# Altium project LimeSDR-QPCIe_1v2.PrjPcb (part 4 of 13)

## Sheet 11_RSSI2.SchDoc: RSSI2
size A3; Organization: Lime Microsystems; Address1: Surrey Tech Centre; Address2: Guildford GU2 7YG; Address3: Surrey; Address4: United Kingdom; Revision: v1.2; SheetNumber: 9; SheetTotal: 27
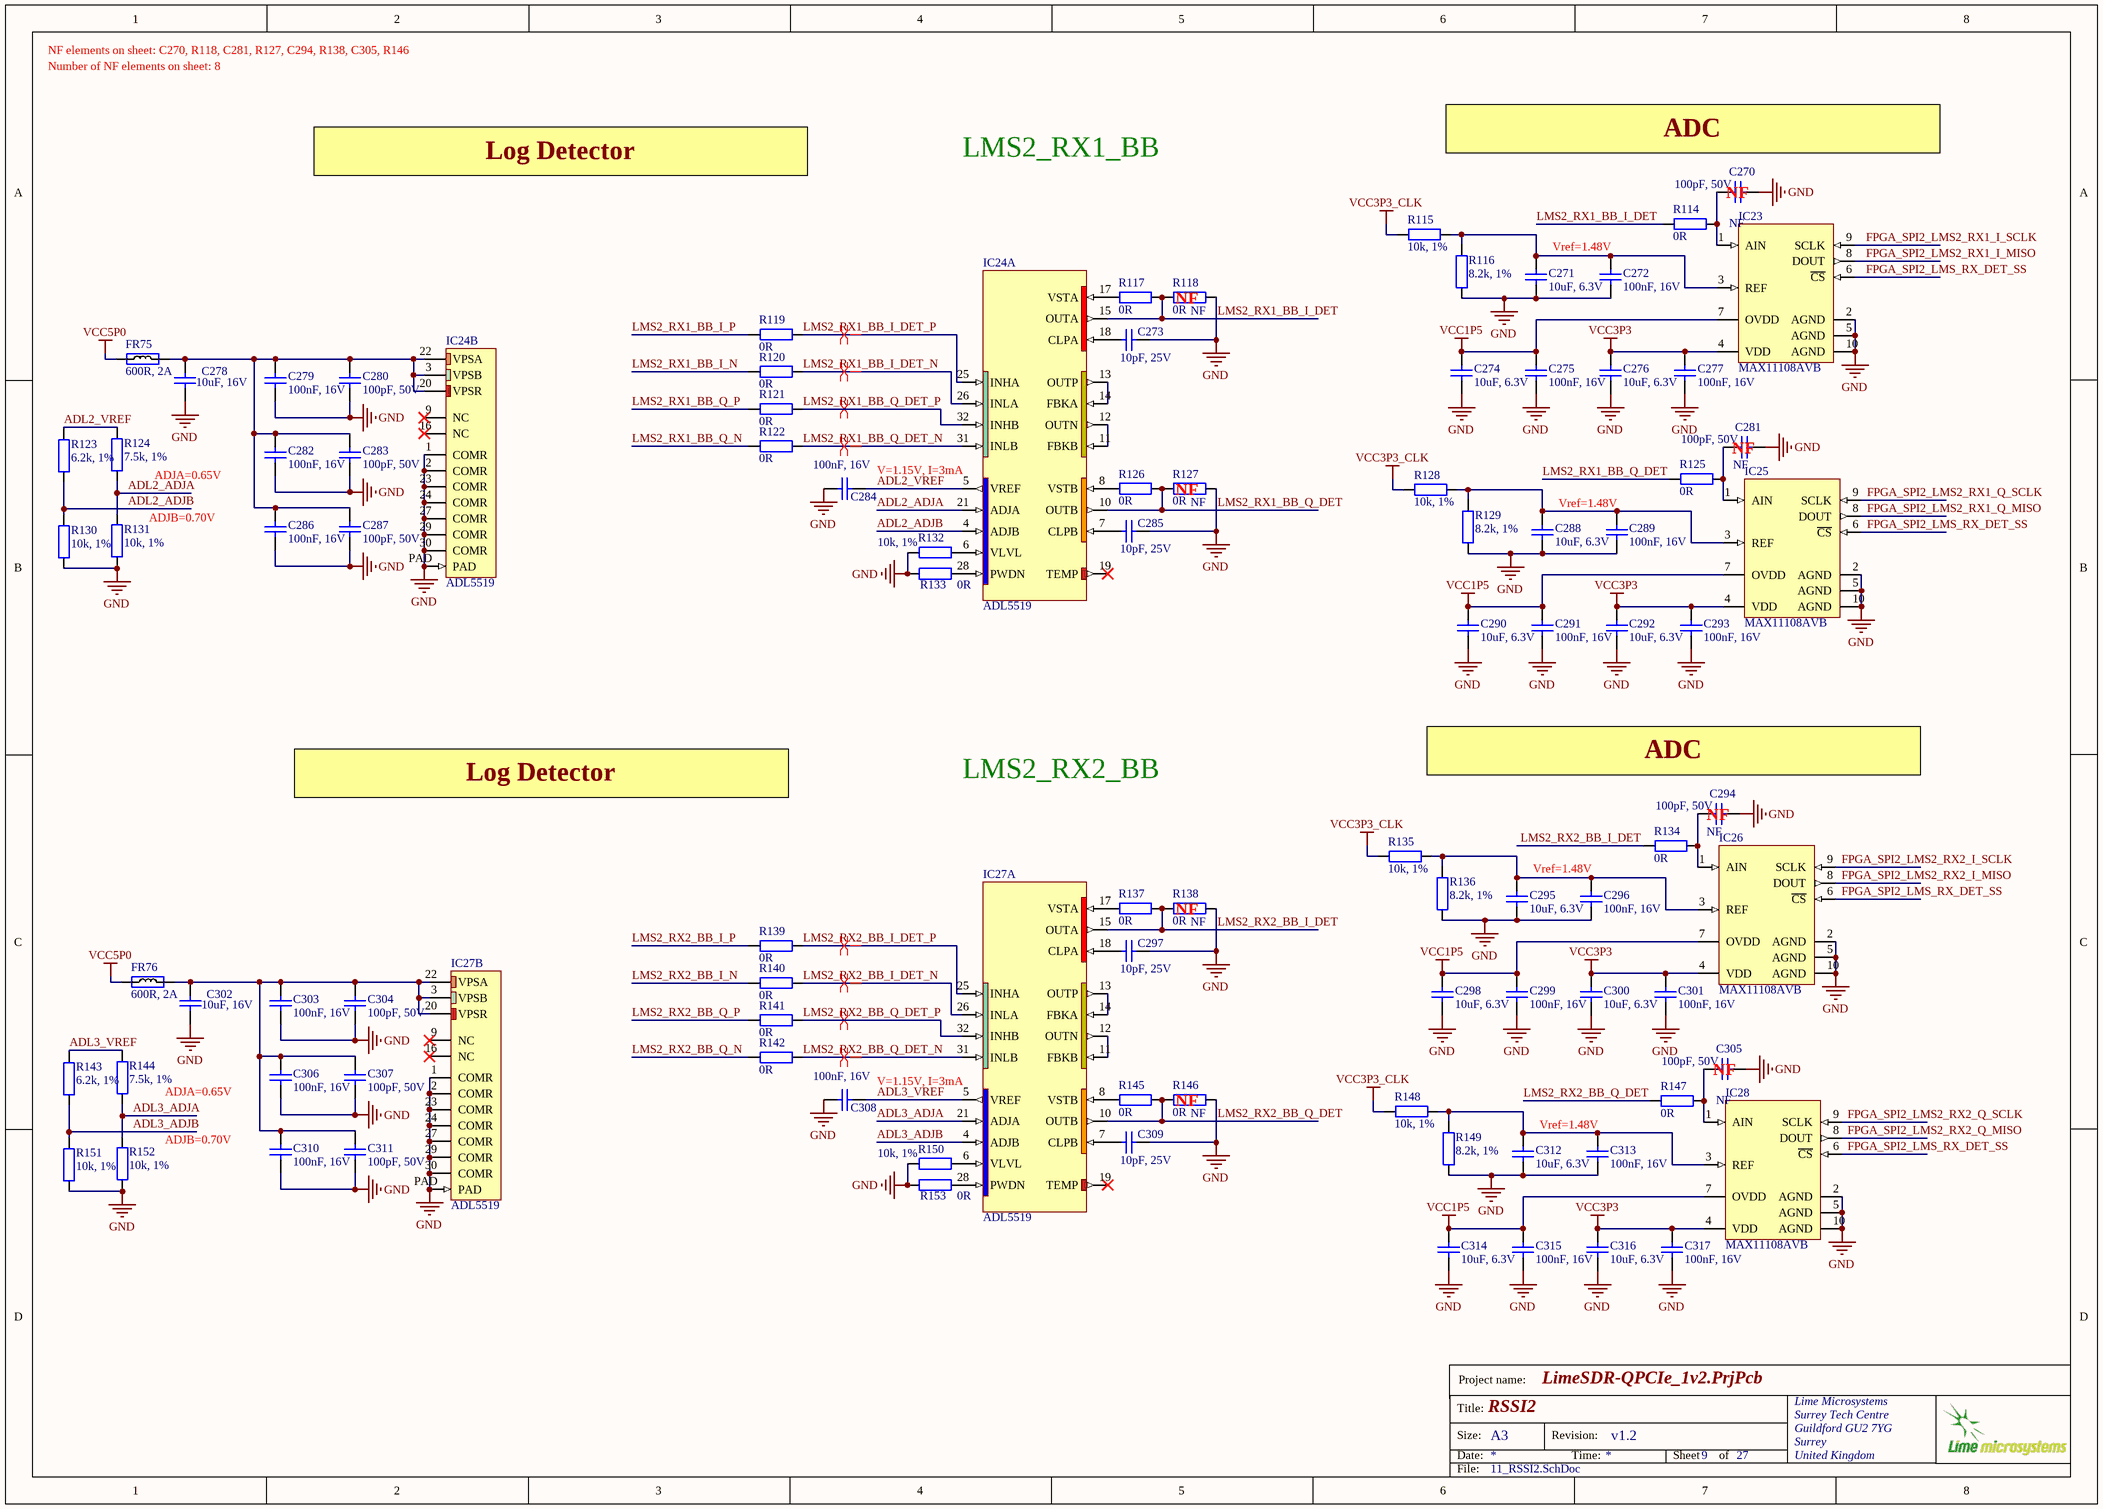
[diagram p10: 11_RSSI2.SchDoc]

### Parts
C270  100pF, 50V  Assembly Info: NF  [CAP0402]
C271  10uF, 6.3V  [CAP0603]
C272  100nF, 16V  [CAP0402]
C273  10pF, 25V  [CAP0402]
C274  10uF, 6.3V  [CAP0603]
C275  100nF, 16V  [CAP0402]
C276  10uF, 6.3V  [CAP0603]
C277  100nF, 16V  [CAP0402]
C278  10uF, 16V  [CAP0603]
C279  100nF, 16V  [CAP0402]
C280  100pF, 50V  [CAP0402]
C281  100pF, 50V  Assembly Info: NF  [CAP0402]
C282  100nF, 16V  [CAP0402]
C283  100pF, 50V  [CAP0402]
C284  100nF, 16V  [CAP0402]
C285  10pF, 25V  [CAP0402]
C286  100nF, 16V  [CAP0402]
C287  100pF, 50V  [CAP0402]
C288  10uF, 6.3V  [CAP0603]
C289  100nF, 16V  [CAP0402]
C290  10uF, 6.3V  [CAP0603]
C291  100nF, 16V  [CAP0402]
C292  10uF, 6.3V  [CAP0603]
C293  100nF, 16V  [CAP0402]
C294  100pF, 50V  Assembly Info: NF  [CAP0402]
C295  10uF, 6.3V  [CAP0603]
C296  100nF, 16V  [CAP0402]
C297  10pF, 25V  [CAP0402]
C298  10uF, 6.3V  [CAP0603]
C299  100nF, 16V  [CAP0402]
C300  10uF, 6.3V  [CAP0603]
C301  100nF, 16V  [CAP0402]
C302  10uF, 16V  [CAP0603]
C303  100nF, 16V  [CAP0402]
C304  100pF, 50V  [CAP0402]
C305  100pF, 50V  Assembly Info: NF  [CAP0402]
C306  100nF, 16V  [CAP0402]
C307  100pF, 50V  [CAP0402]
C308  100nF, 16V  [CAP0402]
C309  10pF, 25V  [CAP0402]
C310  100nF, 16V  [CAP0402]
C311  100pF, 50V  [CAP0402]
C312  10uF, 6.3V  [CAP0603]
C313  100nF, 16V  [CAP0402]
C314  10uF, 6.3V  [CAP0603]
C315  100nF, 16V  [CAP0402]
C316  10uF, 6.3V  [CAP0603]
C317  100nF, 16V  [CAP0402]
FR75  600R, 2A  [RES0805]
FR76  600R, 2A  [RES0805]
IC23  MAX11108AVB  [MAX11108AVB+T]
IC24  ADL5519  [ADL5519_32LFCSP]  (parts A,B of 2)
IC25  MAX11108AVB  [MAX11108AVB+T]
IC26  MAX11108AVB  [MAX11108AVB+T]
IC27  ADL5519  [ADL5519_32LFCSP]  (parts A,B of 2)
IC28  MAX11108AVB  [MAX11108AVB+T]
R114  0R  [RES0402]
R115  10k, 1%  [RES0402]
R116  8.2k, 1%  [RES0402]
R117  0R  [RES0402]
R118  0R  Assembly Info: NF  [RES0402]
R119  0R  [RES0402]
R120  0R  [RES0402]
R121  0R  [RES0402]
R122  0R  [RES0402]
R123  6.2k, 1%  [RES0402]
R124  7.5k, 1%  [RES0402]
R125  0R  [RES0402]
R126  0R  [RES0402]
R127  0R  Assembly Info: NF  [RES0402]
R128  10k, 1%  [RES0402]
R129  8.2k, 1%  [RES0402]
R130  10k, 1%  [RES0402]
R131  10k, 1%  [RES0402]
R132  10k, 1%  [RES0402]
R133  0R  [RES0402]
R134  0R  [RES0402]
R135  10k, 1%  [RES0402]
R136  8.2k, 1%  [RES0402]
R137  0R  [RES0402]
R138  0R  Assembly Info: NF  [RES0402]
R139  0R  [RES0402]
R140  0R  [RES0402]
R141  0R  [RES0402]
R142  0R  [RES0402]
R143  6.2k, 1%  [RES0402]
R144  7.5k, 1%  [RES0402]
R145  0R  [RES0402]
R146  0R  Assembly Info: NF  [RES0402]
R147  0R  [RES0402]
R148  10k, 1%  [RES0402]
R149  8.2k, 1%  [RES0402]
R150  10k, 1%  [RES0402]
R151  10k, 1%  [RES0402]
R152  10k, 1%  [RES0402]
R153  0R  [RES0402]

### Nets
GND: C270.1 C271.1 C272.2 C273.2 C274.1 C275.2 C276.1 C277.2 C278.1 C279.1 C280.1 C281.1 C282.1 C283.1 C284.2 C285.2 C286.1 C287.1 C288.1 C289.2 C290.1 C291.2 C292.1 C293.2 C294.1 C295.1 C296.2 C297.2 C298.1 C299.2 C300.1 C301.2 C302.1 C303.1 C304.1 C305.1 C306.1 C307.1 C308.2 C309.2 C310.1 C311.1 C312.1 C313.2 C314.1 C315.2 C316.1 C317.2 IC23.2(AGND) IC23.5(AGND) IC23.10(AGND) IC24.1(COMR) IC24.2(COMR) IC24.23(COMR) IC24.24(COMR) IC24.27(COMR) IC24.29(COMR) IC24.30(COMR) IC24.PAD IC25.2(AGND) IC25.5(AGND) IC25.10(AGND) IC26.2(AGND) IC26.5(AGND) IC26.10(AGND) IC27.1(COMR) IC27.2(COMR) IC27.23(COMR) IC27.24(COMR) IC27.27(COMR) IC27.29(COMR) IC27.30(COMR) IC27.PAD IC28.2(AGND) IC28.5(AGND) IC28.10(AGND) R116.1 R118.1 R127.1 R129.1 R130.1 R131.2 R132.2 R133.2 R136.1 R138.1 R146.1 R149.1 R150.2 R151.1 R152.2 R153.2
VCC1P5: C274.2 C275.1 C290.2 C291.1 C298.2 C299.1 C314.2 C315.1 IC23.7(OVDD) IC25.7(OVDD) IC26.7(OVDD) IC28.7(OVDD)
VCC3P3: C276.2 C277.1 C292.2 C293.1 C300.2 C301.1 C316.2 C317.1 IC23.4(VDD) IC25.4(VDD) IC26.4(VDD) IC28.4(VDD)
VCC3P3_CLK: R115.2 R128.2 R135.2 R148.2
VCC5P0: FR75.1 FR76.1
ADL2_ADJA: IC24.21(ADJA) R124.1 R131.1
ADL2_ADJB: IC24.4(ADJB) R123.1 R130.2
ADL2_VREF: C284.1 IC24.5(VREF) R123.2 R124.2
ADL3_ADJA: IC27.21(ADJA) R144.1 R152.1
ADL3_ADJB: IC27.4(ADJB) R143.1 R151.2
ADL3_VREF: C308.1 IC27.5(VREF) R143.2 R144.2
FPGA_SPI2_LMS2_RX1_I_MISO: IC23.8(DOUT)
FPGA_SPI2_LMS2_RX1_I_SCLK: IC23.9(SCLK)
FPGA_SPI2_LMS2_RX1_Q_MISO: IC25.8(DOUT)
FPGA_SPI2_LMS2_RX1_Q_SCLK: IC25.9(SCLK)
FPGA_SPI2_LMS2_RX2_I_MISO: IC26.8(DOUT)
FPGA_SPI2_LMS2_RX2_I_SCLK: IC26.9(SCLK)
FPGA_SPI2_LMS2_RX2_Q_MISO: IC28.8(DOUT)
FPGA_SPI2_LMS2_RX2_Q_SCLK: IC28.9(SCLK)
FPGA_SPI2_LMS_RX_DET_SS: IC23.6(~{CS}) IC25.6(~{CS}) IC26.6(~{CS}) IC28.6(~{CS})
LMS2_RX1_BB_I_DET: IC24.15(OUTA) R114.2 R117.1 R118.2
LMS2_RX1_BB_I_DET_N: IC24.26(INLA) R120.1
LMS2_RX1_BB_I_DET_P: IC24.25(INHA) R119.1
LMS2_RX1_BB_I_N: R120.2
LMS2_RX1_BB_I_P: R119.2
LMS2_RX1_BB_Q_DET: IC24.10(OUTB) R125.2 R126.1 R127.2
LMS2_RX1_BB_Q_DET_N: IC24.31(INLB) R122.1
LMS2_RX1_BB_Q_DET_P: IC24.32(INHB) R121.1
LMS2_RX1_BB_Q_N: R122.2
LMS2_RX1_BB_Q_P: R121.2
LMS2_RX2_BB_I_DET: IC27.15(OUTA) R134.2 R137.1 R138.2
LMS2_RX2_BB_I_DET_N: IC27.26(INLA) R140.1
LMS2_RX2_BB_I_DET_P: IC27.25(INHA) R139.1
LMS2_RX2_BB_I_N: R140.2
LMS2_RX2_BB_I_P: R139.2
LMS2_RX2_BB_Q_DET: IC27.10(OUTB) R145.1 R146.2 R147.2
LMS2_RX2_BB_Q_DET_N: IC27.31(INLB) R142.1
LMS2_RX2_BB_Q_DET_P: IC27.32(INHB) R141.1
LMS2_RX2_BB_Q_N: R142.2
LMS2_RX2_BB_Q_P: R141.2
NetC270_2: C270.2 IC23.1(AIN) R114.1
NetC271_2: C271.2 C272.1 IC23.3(REF) R115.1 R116.2
NetC273_1: C273.1 IC24.18(CLPA)
NetC278_2: C278.2 C279.2 C280.2 C282.2 C283.2 C286.2 C287.2 FR75.2 IC24.3(VPSB) IC24.20(VPSR) IC24.22(VPSA)
NetC281_2: C281.2 IC25.1(AIN) R125.1
NetC285_1: C285.1 IC24.7(CLPB)
NetC288_2: C288.2 C289.1 IC25.3(REF) R128.1 R129.2
NetC294_2: C294.2 IC26.1(AIN) R134.1
NetC295_2: C295.2 C296.1 IC26.3(REF) R135.1 R136.2
NetC297_1: C297.1 IC27.18(CLPA)
NetC302_2: C302.2 C303.2 C304.2 C306.2 C307.2 C310.2 C311.2 FR76.2 IC27.3(VPSB) IC27.20(VPSR) IC27.22(VPSA)
NetC305_2: C305.2 IC28.1(AIN) R147.1
NetC309_1: C309.1 IC27.7(CLPB)
NetC312_2: C312.2 C313.1 IC28.3(REF) R148.1 R149.2
NetIC24_6: IC24.6(VLVL) R132.1
NetIC24_8: IC24.8(VSTB) R126.2
NetIC24_11: IC24.11(FBKB) IC24.12(OUTN)
NetIC24_13: IC24.13(OUTP) IC24.14(FBKA)
NetIC24_17: IC24.17(VSTA) R117.2
NetIC24_28: IC24.28(PWDN) R133.1
NetIC27_6: IC27.6(VLVL) R150.1
NetIC27_8: IC27.8(VSTB) R145.2
NetIC27_11: IC27.11(FBKB) IC27.12(OUTN)
NetIC27_13: IC27.13(OUTP) IC27.14(FBKA)
NetIC27_17: IC27.17(VSTA) R137.2
NetIC27_28: IC27.28(PWDN) R153.1

Not connected (* = marked no-connect by the designer): IC24 9(NC)* 16(NC)* 19(TEMP)*; IC27 9(NC)* 16(NC)* 19(TEMP)*

### Layout directives
differential pair: LMS2_RX1_BB_I_DET_N, LMS2_RX1_BB_I_DET_P, LMS2_RX1_BB_Q_DET_N, LMS2_RX1_BB_Q_DET_P, LMS2_RX2_BB_I_DET_N, LMS2_RX2_BB_I_DET_P, LMS2_RX2_BB_Q_DET_N, LMS2_RX2_BB_Q_DET_P

### Notes on the sheet
- NF elements on sheet: C270, R118, C281, R127, C294, R138, C305, R146
- Number of NF elements on sheet: 8
- Log Detector
- LMS2_RX1_BB
- (near C270) ADC
- Vref=1.48V
- (near C270) NF
- (near R118) NF
- ADJA=0.65V
- V=1.15V, I=3mA
- (near R127) NF
- (near C281) NF
- (near R131) ADJB=0.70V
- LMS2_RX2_BB
- (near C294) ADC
- (near C294) NF
- (near R138) NF
- (near R146) NF
- (near C305) NF
- ADJB=0.70V
- Project name:
- Title:
- Size:
- Date:
- A3
- Revision:
- Time:
- Sheet
- of
- File:

### Library data of the parts
C270 C280 C281 C283 C287 C294 C304 C305 C307 C311 = Cap_0402: Manufacturer Part Number 1: CC0402JRNPO9BN101; Manufacturer: Yageo; Part Description: 100pF ±5% 50V C0G, NP0 Ceramic Capacitor -55°C ~ 125°C Surface Mount, MLCC 0402 (1005 Metric) 0.039" L x 0.020" W (1.00mm x 0.50mm); Temperature Coefficient: C0G, NP0; Tolerance: ±5%; Value: 100pF, 50V; Supplier 1: Digi-Key; Supplier Part Number 1: 311-1024-1-ND; RoHS: RoHS Compliant; Category: Capacitors; Applications: General Purpose; Mounting Type: Surface Mount, MLCC; Capacitance: 100pF; Ratings: -; Packaging: Cut Tape (CT); Voltage - Rated: 50V; Size / Dimension: 0.039" L x 0.020" W (1.00mm x 0.50mm); Height - Seated (Max): -; Package / Case: 0402 (1005 Metric); Operating Temperature: -55°C ~ 125°C; Features: -; Lead Spacing: -; Lead Style: -; Thickness (Max): 0.022" (0.55mm)
C271 C274 C276 C288 C290 C292 C295 C298 C300 C312 C314 C316 = Cap_0603: Manufacturer Part Number 1: CC0603MRX5R5BB106; Part Description: 10µF ±20% 6.3V Ceramic Capacitor X5R 0603 (1608 Metric); Manufacturer: Yageo; Capacitance: 10µF; Tolerance: ±20%; Supplier 1: Digi-Key; Supplier Part Number 1: 311-1448-2-ND; Package / Case: 0603 (1608 Metric); Category: Capacitors; Voltage - Rated: 6.3V; Value: 10uF, 6.3V
C272 C275 C277 C279 C282 C284 C286 C289 C291 C293 C296 C299 C301 C303 C306 C308 C310 C313 C315 C317 = Cap_0402: as C177-C180 on sheet 09_RF_Loopback; Value: 100nF, 16V; Supplier 1: Mouser; Supplier Part Number 1: 81-GRM155R71C104KA88; Case Code - in: 0402; RoHS: RoHS Compliant; Operating Temperature Range: - 55 C to + 125 C; Series: GRM; Termination Style: SMD/SMT; Package / Case: 0402 (1005 metric); Voltage Rating DC: 16 V; Maximum Operating Temperature: + 125 C; Case Code - mm: 1005; Minimum Operating Temperature: - 55 C; Product Category: Low & Medium Capacitance SMD Ceramic Chip Capacitors; Packaging: Reel; Product: General Type MLCCs; Category: Multilayer Ceramic Capacitors MLCC - SMD/SMT; Brand: Murata Electronics; Case Width: 0.5 mm; RoHS - Mouser: Y; Standard Pack Qty: 10000; Minimum Order Quantity: 1; Reeling: True; Manufacturer Part Number 1: GRM155R71C104KA88D
C273 C285 C297 C309 = Cap_0402: Manufacturer Part Number 1: 04023A100JAT2A; Manufacturer: AVX; Part Description: 10pF ±5% 25V Ceramic Capacitor C0G, NP0 0402 (1005 Metric); Capacitance Tolerance: ± 5%; Voltage Rating: 25; Ceramic Capacitor Case: 0402 [1005 Metric]; Capacitor Case Style: 0402 [1005 Metric]<!--FANDB--><div class="features-and-benefits-container"></div>; Dielectric Characteristic: C0G / NP0; SVHC: No SVHC (16-Jun-2014); Capacitance: 10; Value: 10pF, 25V; Supplier 1: Farnell; Supplier Part Number 1: 2332478RL; Product Range: -; RoHS: YES; Operating Temperature Min: -55; Operating Temperature Max: 125; Capacitance Tolerance ±: ± 5%; MSL: MSL 1 - Unlimited; Packaging: Cut Tape
C278 C302 = Cap_0603: Manufacturer: Yageo; Manufacturer Part Number 1: GRM188R61C106MA73D; Part Description: 10µF ±20% 16V Ceramic Capacitor X5R 0603 (1608 Metric); Temperature Coefficient: X5R; Capacitance: 10µF; Tolerance: ±20%; Value: 10uF, 16V; Supplier 1: Digi-Key; Supplier Part Number 1: 490-7201-2-ND; Category: Capacitors; Ratings: -; Features: -; Lead Style: -; Package / Case: 0603 (1608 Metric); Lead Spacing: -; Applications: General Purpose; Voltage - Rated: 16V; Operating Temperature: -55°C ~ 85°C; Thickness (Max): 0.039" (1.00mm); Mounting Type: Surface Mount, MLCC; RoHS: RoHS Compliant; Size / Dimension: 0.063" L x 0.031" W (1.60mm x 0.80mm); Packaging: Tape & Reel (TR); Height - Seated (Max): -
FR75 FR76 = Ferrite: Manufacturer Part Number 1: MPZ2012S601A; Manufacturer: TDK; Part Description: FERRITE BEAD 600 OHM 0805 1LN; Filter Type: Differential Mode - Single; Impedance @ Frequency: 600 Ohm @ 100MHz; DC Resistance (DCR): 100 mOhm Max; DC Current Rating: 2; DC Resistance Max: 0.1; Ferrite Case Style: 0805 [2012 Metric]; Ferrite Mounting: SMD; Impedance @ 100MHz: 600; Impedance Tolerance: ± 25%; Supplier 1: Farnell; Supplier Part Number 1: 1669753RL; Mounting Type: Surface Mount; RoHS: RoHS Compliant; Height (Max): 0.041" (1.05mm); Packaging: Tape & Reel (TR); Category: Filters; Current Rating: 2A; Package / Case: 0805 (2012 Metric); Size / Dimension: 0.079" L x 0.049" W (2.00mm x 1.25mm); Value: 600R, 2A; Core Material: Ferrite; Supplier: Farnell
IC23 IC25 IC26 IC28 = MAX11108AVB+T: Part Description: 12 Bit Analog to Digital Converter 1 Input 1 SAR 10-UTQFN (2.1x1.6); Manufacturer: Maxim Integrated; Number of Bits: 12; Sampling Rate (Per Second): 3M; Number of Inputs: 1; Input Type: Single Ended; Data Interface: SPI; Configuration: S/H-ADC; Ratio - S/H:ADC: 1:1; Architecture: SAR; Reference Type: External; Voltage - Supply, Analog: 2.2 V ~ 3.6 V; Supplier 1: Digi-Key; Manufacturer Part Number 1: MAX11108AVB+T; RoHS: RoHS Compliant; Category: Integrated Circuits (ICs); Stock 1: 4253; Pricing 1: 1=4.05, 10=3.825, 25=3.06, 50=2.907, 100=2.6775, 250=2.5398, 500=2.44802 (USD); Packaging: Cut Tape (CT); Part Status: Active; Number of A/D Converters: 1; Voltage - Supply, Digital: 2.2 V ~ 3.6 V; Features: -; Operating Temperature: -40°C ~ 125°C; Package / Case: 10-UFQFN; Supplier Device Package: 10-UTQFN (2.1x1.6); ComponentLink1URL: http://datasheets.maximintegrated.com/en/ds/MAX11108.pdf; ComponentLink1Description: http://datasheets.maximintegrated.com/en/ds/MAX11108.pdf; Supplier Part Number 1: MAX11108AVB+TCT-ND
IC24 IC27 = ADL5519: Manufacturer: Analog Devices Inc.; Manufacturer Part Number 1: ADL5519ACPZ-R7; Part Description: RF IC Detector/Controller WiMax, WLAN 1MHz ~ 10GHz 32-LFCSP-VQ (5x5); Function: Detector/Controller; Frequency: 1MHz ~ 10GHz; RF Type: WiMax, WLAN; Supplier 1: Digi-Key; RoHS: RoHS Compliant; Category: RF/IF and RFID; Stock 1: 993; Pricing 1: 1=11.11, 10=10.214, 100=8.626, 500=7.6734 (USD); Packaging: Cut Tape (CT); Part Status: Active; Secondary Attributes: -; Package / Case: 32-VFQFN Exposed Pad, CSP; Supplier Device Package: 32-LFCSP-VQ (5x5); ComponentLink1URL: http://www.analog.com/media/en/technical-documentation/data-sheets/ADL5519.pdf; ComponentLink1Description: http://www.analog.com/media/en/technical-documentation/data-sheets/ADL5519.pdf; Supplier Part Number 1: ADL5519ACPZ-R7CT-ND
R114 R117-R122 R125-R127 R133 R134 R137-R142 R145-R147 R153 = Res_0402: Manufacturer Part Number 1: RC0402JR-070RL; Manufacturer: Yageo; Part Description: RES SMD 0.0OHM JUMPER 1/16W 0402; Resistance (Ohms): 0.0; Tolerance: Jumper; Power (Watts): 0.063W, 1/16W; Value: 0R; Supplier 1: Digi-Key; Supplier Part Number 1: 311-0.0JRTR-ND; Category: Resistors; Temperature Coefficient: -; Features: Moisture Resistant; Supplier Device Package: 0402; Height: 0.016" (0.40mm); Package / Case: 0402 (1005 Metric); Operating Temperature: -55°C ~ 155°C; Size / Dimension: 0.039" L x 0.020" W (1.00mm x 0.50mm); Composition: Thick Film; Packaging: Tape & Reel (TR); Number of Terminations: 2; RoHS: RoHS Compliant
R115 R128 R130-R132 R135 R148 R150-R152 = Res_0402: Manufacturer: Yageo; Manufacturer Part Number 1: RC0402FR-0710KL; Part Description: RES SMD 10K OHM 1% 1/16W 0402; Temperature Coefficient: ±100ppm/°C; Power (Watts): 0.063W, 1/16W; Value: 10k, 1%; Supplier 1: Digi-Key; Supplier Part Number 1: 311-10.0KLRTR-ND; Resistance (Ohms): 10k; Packaging: Tape & Reel (TR); RoHS: RoHS Compliant; Package / Case: 0402 (1005 Metric); Tolerance: ±1%; Operating Temperature: -55°C ~ 155°C; Size / Dimension: 0.039" L x 0.020" W (1.00mm x 0.50mm); Number of Terminations: 2; Category: Resistors; Height: 0.016" (0.40mm); Supplier Device Package: 0402; Features: Moisture Resistant; Composition: Thick Film
R116 R129 R136 R149 = Res_0402: Manufacturer: Yageo; Part Description: RES SMD 8.2K OHM 1% 1/16W 0402; Manufacturer Part Number 1: RC0402FR-078K2L; Power (Watts): 0.063W, 1/16W; Temperature Coefficient: ±100ppm/°C; Value: 8.2k, 1%; Supplier 1: Digi-Key; Supplier Device Package: 0402; Package / Case: 0402 (1005 Metric); Height: 0.016" (0.40mm); Supplier Part Number 1: 311-8.20KLRCT-ND; Number of Terminations: 2; Operating Temperature: -55°C ~ 155°C; Resistance (Ohms): 8.2k; Size / Dimension: 0.039" L x 0.020" W (1.00mm x 0.50mm); Composition: Thick Film; Category: Resistors; Tolerance: ±1%; Features: Moisture Resistant; RoHS: RoHS Compliant; Packaging: Cut Tape (CT)
R123 R143 = Res_0402: Manufacturer: Yageo; Manufacturer Part Number: RC0402FR-076K2L; Part Description: ±1% 0.063W, 1/16W Chip Resistor 0402 (1005 Metric) Moisture Resistant Thick Film; Temperature Coefficient: ±100ppm/°C; Power (Watts): 0.063W, 1/16W; Value: 6.2k, 1%; Supplier Device Package: 0402; Package / Case: 0402 (1005 Metric); Failure Rate: -; Operating Temperature: -55°C ~ 155°C; Height - Seated (Max): 0.016" (0.40mm); Tolerance: ±1%; Category: Resistors; Part Status: Active; Packaging: Cut Tape (CT); RoHS: RoHS Compliant; Size / Dimension: 0.039" L x 0.020" W (1.00mm x 0.50mm); Supplier 1: Digi-Key; Supplier Part Number 1: 311-6.20KLRCT-ND; Features: Moisture Resistant; Composition: Thick Film
R124 R144 = Res_0402: Manufacturer Part Number: RC0402FR-077K5L; Manufacturer: Yageo; Part Description: ±1% 0.063W, 1/16W Chip Resistor 0402 (1005 Metric) Automotive AEC-Q200, Moisture Resistant Thick Film; Power (Watts): 0.063W, 1/16W; Temperature Coefficient: ±100ppm/°C; Value: 7.5k, 1%; Packaging: Cut Tape (CT); Tolerance: ±1%; RoHS: RoHS Compliant; Supplier Device Package: 0402; Size / Dimension: 0.039" L x 0.020" W (1.00mm x 0.50mm); Category: Resistors; Failure Rate: -; Supplier 1: Digi-Key; Composition: Thick Film; Package / Case: 0402 (1005 Metric); Supplier Part Number 1: YAG3512CT-ND; Features: Automotive AEC-Q200, Moisture Resistant; Height - Seated (Max): 0.015" (0.37mm); Part Status: Active; Operating Temperature: -55°C ~ 155°C

## Sheet 12_FPGA_banks_3A_3B_4A.SchDoc: FPGA banks 3A, 3B, 4A
size A3; Organization: Lime Microsystems; Address1: Surrey Tech Centre; Address2: Guildford GU2 7YG; Address3: Surrey; Address4: United Kingdom; Revision: v1.2; SheetNumber: 10; SheetTotal: 27
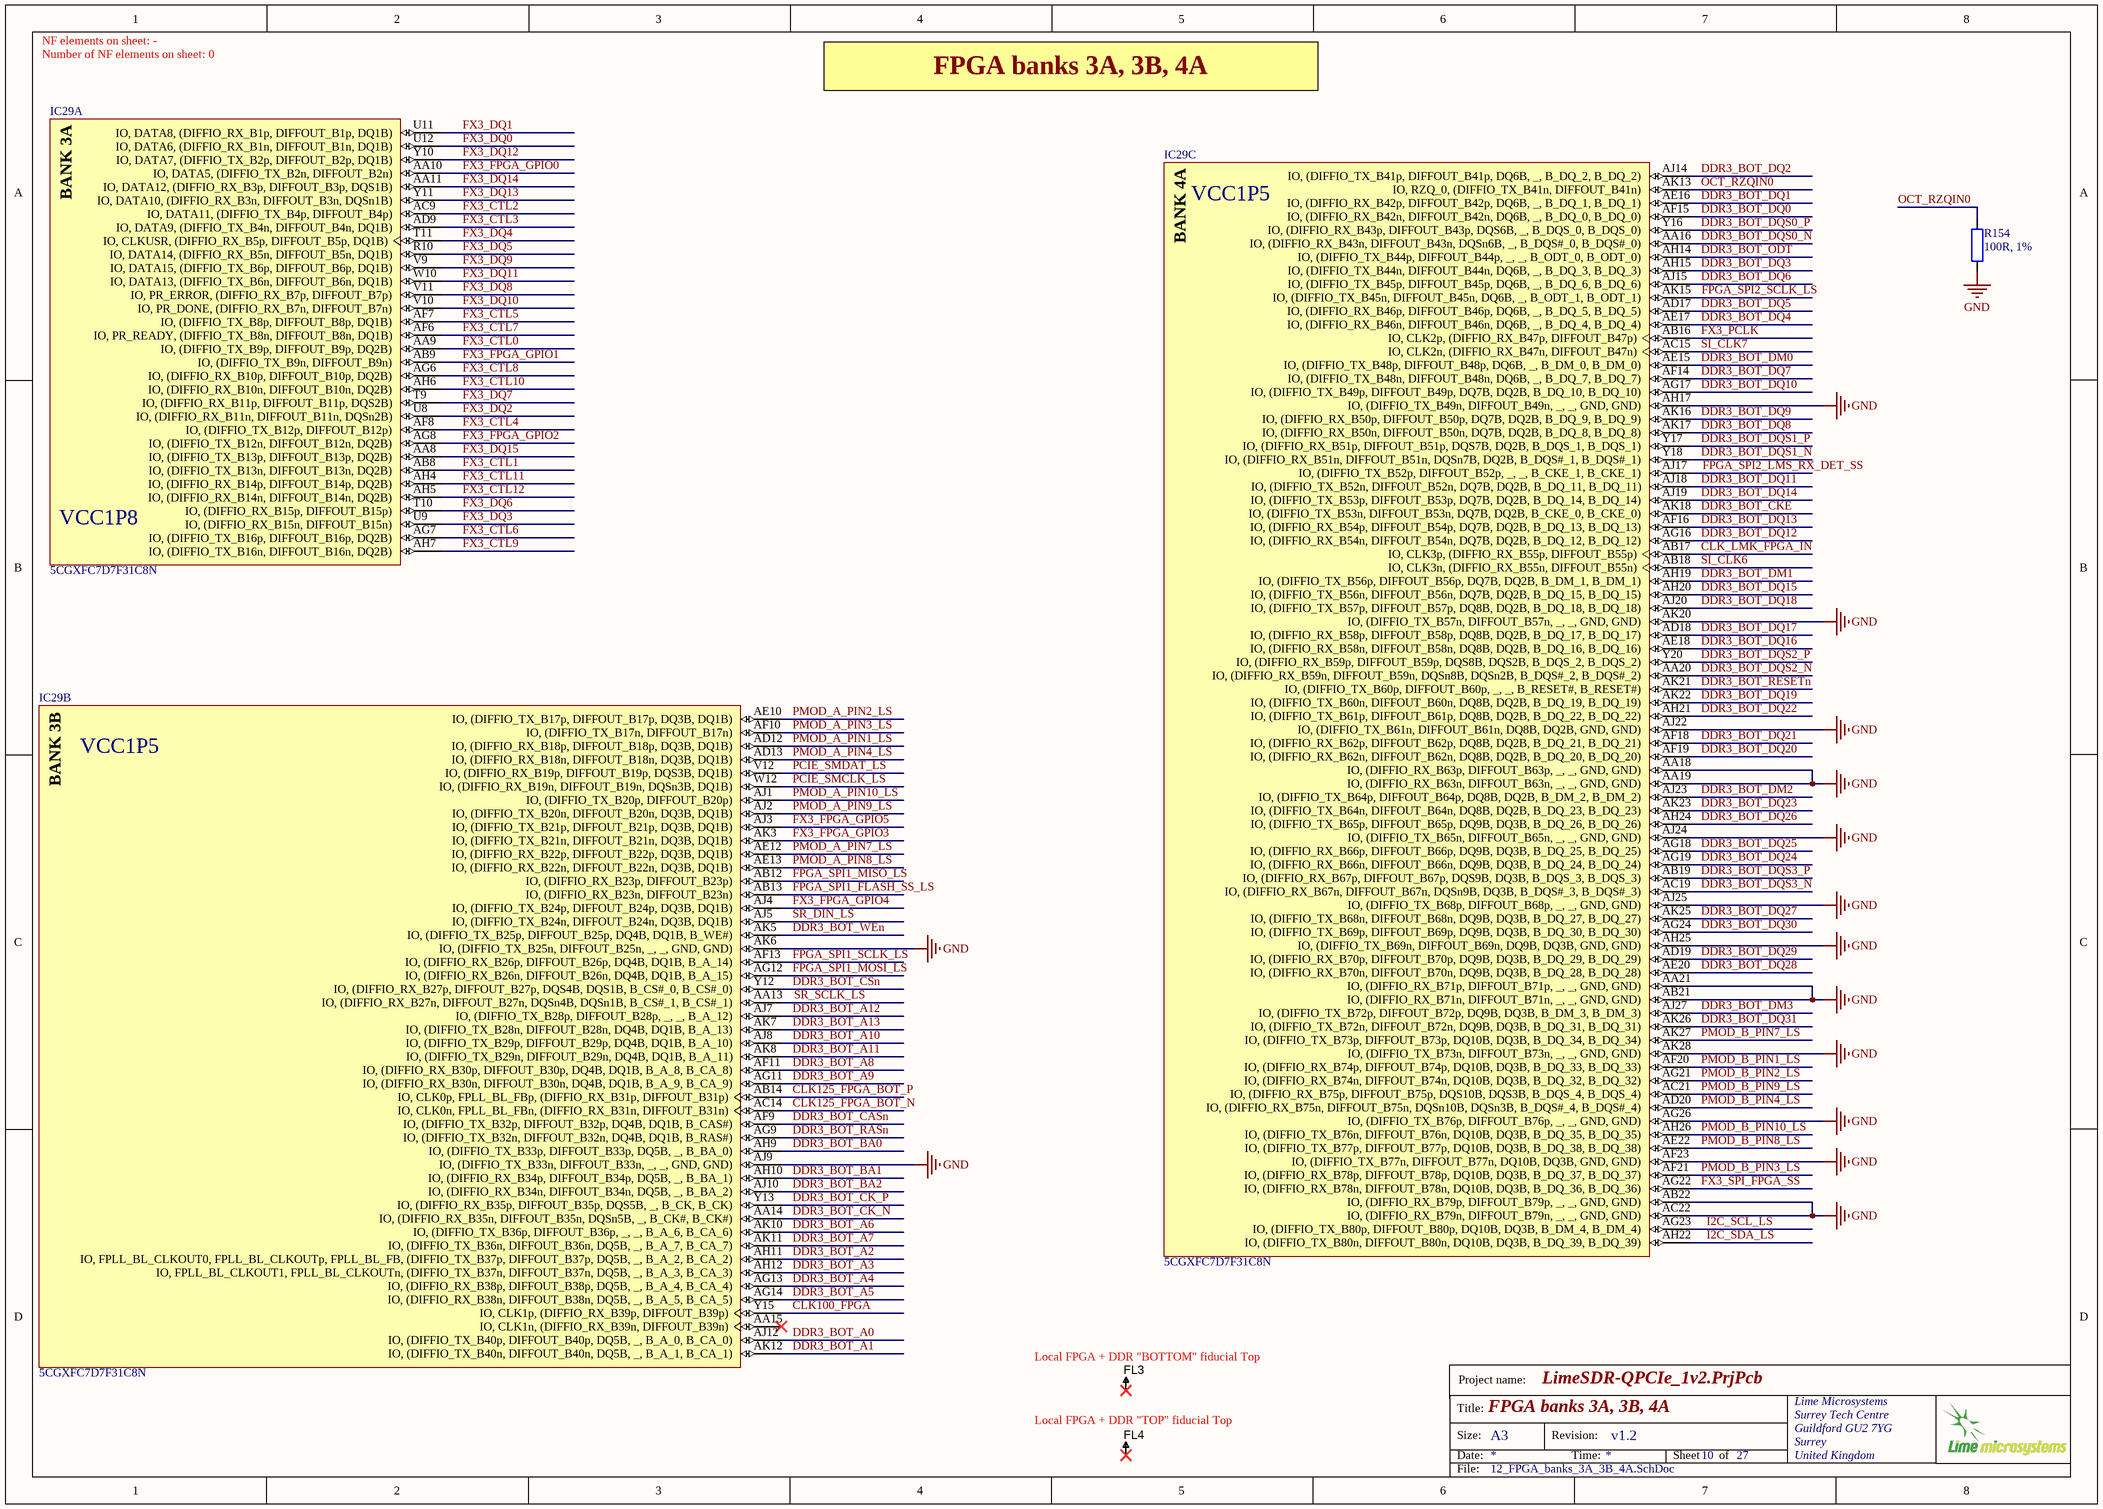
[diagram p11: 12_FPGA_banks_3A_3B_4A.SchDoc]

### Parts
FL3  Fiducial  [Fiducial_local]  (value not drawn)
FL4  Fiducial  [Fiducial_local]  (value not drawn)
IC29  5CGXFC7D7F31C8N  [ALTR-FBGA896_A-200]  (parts A,B,C of 16)
R154  100R, 1%  [RES0402]

### Nets
GND: IC29.AA18(IO,_(DIFFIO_RX_B63p,_DIFFOUT_B63p,__,__,_GND,_GND)) IC29.AA19(IO,_(DIFFIO_RX_B63n,_DIFFOUT_B63n,__,__,_GND,_GND)) IC29.AA21(IO,_(DIFFIO_RX_B71p,_DIFFOUT_B71p,__,__,_GND,_GND)) IC29.AB21(IO,_(DIFFIO_RX_B71n,_DIFFOUT_B71n,__,__,_GND,_GND)) IC29.AB22(IO,_(DIFFIO_RX_B79p,_DIFFOUT_B79p,__,__,_GND,_GND)) IC29.AC22(IO,_(DIFFIO_RX_B79n,_DIFFOUT_B79n,__,__,_GND,_GND)) IC29.AF23(IO,_(DIFFIO_TX_B77n,_DIFFOUT_B77n,_DQ10B,_DQ3B,_GND,_GND)) IC29.AG26(IO,_(DIFFIO_TX_B76p,_DIFFOUT_B76p,__,__,_GND,_GND)) IC29.AH17(IO,_(DIFFIO_TX_B49n,_DIFFOUT_B49n,__,__,_GND,_GND)) IC29.AH25(IO,_(DIFFIO_TX_B69n,_DIFFOUT_B69n,_DQ9B,_DQ3B,_GND,_GND)) IC29.AJ9(IO,_(DIFFIO_TX_B33n,_DIFFOUT_B33n,__,__,_GND,_GND)) IC29.AJ22(IO,_(DIFFIO_TX_B61n,_DIFFOUT_B61n,_DQ8B,_DQ2B,_GND,_GND)) IC29.AJ24(IO,_(DIFFIO_TX_B65n,_DIFFOUT_B65n,__,__,_GND,_GND)) IC29.AJ25(IO,_(DIFFIO_TX_B68p,_DIFFOUT_B68p,__,__,_GND,_GND)) IC29.AK6(IO,_(DIFFIO_TX_B25n,_DIFFOUT_B25n,__,__,_GND,_GND)) IC29.AK20(IO,_(DIFFIO_TX_B57n,_DIFFOUT_B57n,__,__,_GND,_GND)) IC29.AK28(IO,_(DIFFIO_TX_B73n,_DIFFOUT_B73n,__,__,_GND,_GND)) R154.1
CLK100_FPGA: IC29.Y15(IO,_CLK1p,_(DIFFIO_RX_B39p,_DIFFOUT_B39p))
CLK125_FPGA_BOT_N: IC29.AC14(IO,_CLK0n,_FPLL_BL_FBn,_(DIFFIO_RX_B31n,_DIFFOUT_B31n))
CLK125_FPGA_BOT_P: IC29.AB14(IO,_CLK0p,_FPLL_BL_FBp,_(DIFFIO_RX_B31p,_DIFFOUT_B31p))
CLK_LMK_FPGA_IN: IC29.AB17(IO,_CLK3p,_(DIFFIO_RX_B55p,_DIFFOUT_B55p))
DDR3_BOT_A0: IC29.AJ12(IO,_(DIFFIO_TX_B40p,_DIFFOUT_B40p,_DQ5B,__,_B_A_0,_B_CA_0))
DDR3_BOT_A1: IC29.AK12(IO,_(DIFFIO_TX_B40n,_DIFFOUT_B40n,_DQ5B,__,_B_A_1,_B_CA_1))
DDR3_BOT_A2: IC29.AH11(IO,_FPLL_BL_CLKOUT0,_FPLL_BL_CLKOUTp,_FPLL_BL_FB,_(DIFFIO_TX_B37p,_DIFFOUT_B37p,_DQ5B,__,_B_A_2,_B_CA_2))
DDR3_BOT_A3: IC29.AH12(IO,_FPLL_BL_CLKOUT1,_FPLL_BL_CLKOUTn,_(DIFFIO_TX_B37n,_DIFFOUT_B37n,_DQ5B,__,_B_A_3,_B_CA_3))
DDR3_BOT_A4: IC29.AG13(IO,_(DIFFIO_RX_B38p,_DIFFOUT_B38p,_DQ5B,__,_B_A_4,_B_CA_4))
DDR3_BOT_A5: IC29.AG14(IO,_(DIFFIO_RX_B38n,_DIFFOUT_B38n,_DQ5B,__,_B_A_5,_B_CA_5))
DDR3_BOT_A6: IC29.AK10(IO,_(DIFFIO_TX_B36p,_DIFFOUT_B36p,__,__,_B_A_6,_B_CA_6))
DDR3_BOT_A7: IC29.AK11(IO,_(DIFFIO_TX_B36n,_DIFFOUT_B36n,_DQ5B,__,_B_A_7,_B_CA_7))
DDR3_BOT_A8: IC29.AF11(IO,_(DIFFIO_RX_B30p,_DIFFOUT_B30p,_DQ4B,_DQ1B,_B_A_8,_B_CA_8))
DDR3_BOT_A9: IC29.AG11(IO,_(DIFFIO_RX_B30n,_DIFFOUT_B30n,_DQ4B,_DQ1B,_B_A_9,_B_CA_9))
DDR3_BOT_A10: IC29.AJ8(IO,_(DIFFIO_TX_B29p,_DIFFOUT_B29p,_DQ4B,_DQ1B,_B_A_10))
DDR3_BOT_A11: IC29.AK8(IO,_(DIFFIO_TX_B29n,_DIFFOUT_B29n,_DQ4B,_DQ1B,_B_A_11))
DDR3_BOT_A12: IC29.AJ7(IO,_(DIFFIO_TX_B28p,_DIFFOUT_B28p,__,__,_B_A_12))
DDR3_BOT_A13: IC29.AK7(IO,_(DIFFIO_TX_B28n,_DIFFOUT_B28n,_DQ4B,_DQ1B,_B_A_13))
DDR3_BOT_BA0: IC29.AH9(IO,_(DIFFIO_TX_B33p,_DIFFOUT_B33p,_DQ5B,__,_B_BA_0))
DDR3_BOT_BA1: IC29.AH10(IO,_(DIFFIO_RX_B34p,_DIFFOUT_B34p,_DQ5B,__,_B_BA_1))
DDR3_BOT_BA2: IC29.AJ10(IO,_(DIFFIO_RX_B34n,_DIFFOUT_B34n,_DQ5B,__,_B_BA_2))
DDR3_BOT_CASn: IC29.AF9(IO,_(DIFFIO_TX_B32p,_DIFFOUT_B32p,_DQ4B,_DQ1B,_B_CAS#))
DDR3_BOT_CK_N: IC29.AA14(IO,_(DIFFIO_RX_B35n,_DIFFOUT_B35n,_DQSn5B,__,_B_CK#,_B_CK#))
DDR3_BOT_CK_P: IC29.Y13(IO,_(DIFFIO_RX_B35p,_DIFFOUT_B35p,_DQS5B,__,_B_CK,_B_CK))
DDR3_BOT_CKE: IC29.AK18(IO,_(DIFFIO_TX_B53n,_DIFFOUT_B53n,_DQ7B,_DQ2B,_B_CKE_0,_B_CKE_0))
DDR3_BOT_CSn: IC29.Y12(IO,_(DIFFIO_RX_B27p,_DIFFOUT_B27p,_DQS4B,_DQS1B,_B_CS#_0,_B_CS#_0))
DDR3_BOT_DM0: IC29.AE15(IO,_(DIFFIO_TX_B48p,_DIFFOUT_B48p,_DQ6B,__,_B_DM_0,_B_DM_0))
DDR3_BOT_DM1: IC29.AH19(IO,_(DIFFIO_TX_B56p,_DIFFOUT_B56p,_DQ7B,_DQ2B,_B_DM_1,_B_DM_1))
DDR3_BOT_DM2: IC29.AJ23(IO,_(DIFFIO_TX_B64p,_DIFFOUT_B64p,_DQ8B,_DQ2B,_B_DM_2,_B_DM_2))
DDR3_BOT_DM3: IC29.AJ27(IO,_(DIFFIO_TX_B72p,_DIFFOUT_B72p,_DQ9B,_DQ3B,_B_DM_3,_B_DM_3))
DDR3_BOT_DQ0: IC29.AF15(IO,_(DIFFIO_RX_B42n,_DIFFOUT_B42n,_DQ6B,__,_B_DQ_0,_B_DQ_0))
DDR3_BOT_DQ1: IC29.AE16(IO,_(DIFFIO_RX_B42p,_DIFFOUT_B42p,_DQ6B,__,_B_DQ_1,_B_DQ_1))
DDR3_BOT_DQ2: IC29.AJ14(IO,_(DIFFIO_TX_B41p,_DIFFOUT_B41p,_DQ6B,__,_B_DQ_2,_B_DQ_2))
DDR3_BOT_DQ3: IC29.AH15(IO,_(DIFFIO_TX_B44n,_DIFFOUT_B44n,_DQ6B,__,_B_DQ_3,_B_DQ_3))
DDR3_BOT_DQ4: IC29.AE17(IO,_(DIFFIO_RX_B46n,_DIFFOUT_B46n,_DQ6B,__,_B_DQ_4,_B_DQ_4))
DDR3_BOT_DQ5: IC29.AD17(IO,_(DIFFIO_RX_B46p,_DIFFOUT_B46p,_DQ6B,__,_B_DQ_5,_B_DQ_5))
DDR3_BOT_DQ6: IC29.AJ15(IO,_(DIFFIO_TX_B45p,_DIFFOUT_B45p,_DQ6B,__,_B_DQ_6,_B_DQ_6))
DDR3_BOT_DQ7: IC29.AF14(IO,_(DIFFIO_TX_B48n,_DIFFOUT_B48n,_DQ6B,__,_B_DQ_7,_B_DQ_7))
DDR3_BOT_DQ8: IC29.AK17(IO,_(DIFFIO_RX_B50n,_DIFFOUT_B50n,_DQ7B,_DQ2B,_B_DQ_8,_B_DQ_8))
DDR3_BOT_DQ9: IC29.AK16(IO,_(DIFFIO_RX_B50p,_DIFFOUT_B50p,_DQ7B,_DQ2B,_B_DQ_9,_B_DQ_9))
DDR3_BOT_DQ10: IC29.AG17(IO,_(DIFFIO_TX_B49p,_DIFFOUT_B49p,_DQ7B,_DQ2B,_B_DQ_10,_B_DQ_10))
DDR3_BOT_DQ11: IC29.AJ18(IO,_(DIFFIO_TX_B52n,_DIFFOUT_B52n,_DQ7B,_DQ2B,_B_DQ_11,_B_DQ_11))
DDR3_BOT_DQ12: IC29.AG16(IO,_(DIFFIO_RX_B54n,_DIFFOUT_B54n,_DQ7B,_DQ2B,_B_DQ_12,_B_DQ_12))
DDR3_BOT_DQ13: IC29.AF16(IO,_(DIFFIO_RX_B54p,_DIFFOUT_B54p,_DQ7B,_DQ2B,_B_DQ_13,_B_DQ_13))
DDR3_BOT_DQ14: IC29.AJ19(IO,_(DIFFIO_TX_B53p,_DIFFOUT_B53p,_DQ7B,_DQ2B,_B_DQ_14,_B_DQ_14))
DDR3_BOT_DQ15: IC29.AH20(IO,_(DIFFIO_TX_B56n,_DIFFOUT_B56n,_DQ7B,_DQ2B,_B_DQ_15,_B_DQ_15))
DDR3_BOT_DQ16: IC29.AE18(IO,_(DIFFIO_RX_B58n,_DIFFOUT_B58n,_DQ8B,_DQ2B,_B_DQ_16,_B_DQ_16))
DDR3_BOT_DQ17: IC29.AD18(IO,_(DIFFIO_RX_B58p,_DIFFOUT_B58p,_DQ8B,_DQ2B,_B_DQ_17,_B_DQ_17))
DDR3_BOT_DQ18: IC29.AJ20(IO,_(DIFFIO_TX_B57p,_DIFFOUT_B57p,_DQ8B,_DQ2B,_B_DQ_18,_B_DQ_18))
DDR3_BOT_DQ19: IC29.AK22(IO,_(DIFFIO_TX_B60n,_DIFFOUT_B60n,_DQ8B,_DQ2B,_B_DQ_19,_B_DQ_19))
DDR3_BOT_DQ20: IC29.AF19(IO,_(DIFFIO_RX_B62n,_DIFFOUT_B62n,_DQ8B,_DQ2B,_B_DQ_20,_B_DQ_20))
DDR3_BOT_DQ21: IC29.AF18(IO,_(DIFFIO_RX_B62p,_DIFFOUT_B62p,_DQ8B,_DQ2B,_B_DQ_21,_B_DQ_21))
DDR3_BOT_DQ22: IC29.AH21(IO,_(DIFFIO_TX_B61p,_DIFFOUT_B61p,_DQ8B,_DQ2B,_B_DQ_22,_B_DQ_22))
DDR3_BOT_DQ23: IC29.AK23(IO,_(DIFFIO_TX_B64n,_DIFFOUT_B64n,_DQ8B,_DQ2B,_B_DQ_23,_B_DQ_23))
DDR3_BOT_DQ24: IC29.AG19(IO,_(DIFFIO_RX_B66n,_DIFFOUT_B66n,_DQ9B,_DQ3B,_B_DQ_24,_B_DQ_24))
DDR3_BOT_DQ25: IC29.AG18(IO,_(DIFFIO_RX_B66p,_DIFFOUT_B66p,_DQ9B,_DQ3B,_B_DQ_25,_B_DQ_25))
DDR3_BOT_DQ26: IC29.AH24(IO,_(DIFFIO_TX_B65p,_DIFFOUT_B65p,_DQ9B,_DQ3B,_B_DQ_26,_B_DQ_26))
DDR3_BOT_DQ27: IC29.AK25(IO,_(DIFFIO_TX_B68n,_DIFFOUT_B68n,_DQ9B,_DQ3B,_B_DQ_27,_B_DQ_27))
DDR3_BOT_DQ28: IC29.AE20(IO,_(DIFFIO_RX_B70n,_DIFFOUT_B70n,_DQ9B,_DQ3B,_B_DQ_28,_B_DQ_28))
DDR3_BOT_DQ29: IC29.AD19(IO,_(DIFFIO_RX_B70p,_DIFFOUT_B70p,_DQ9B,_DQ3B,_B_DQ_29,_B_DQ_29))
DDR3_BOT_DQ30: IC29.AG24(IO,_(DIFFIO_TX_B69p,_DIFFOUT_B69p,_DQ9B,_DQ3B,_B_DQ_30,_B_DQ_30))
DDR3_BOT_DQ31: IC29.AK26(IO,_(DIFFIO_TX_B72n,_DIFFOUT_B72n,_DQ9B,_DQ3B,_B_DQ_31,_B_DQ_31))
DDR3_BOT_DQS0_N: IC29.AA16(IO,_(DIFFIO_RX_B43n,_DIFFOUT_B43n,_DQSn6B,__,_B_DQS#_0,_B_DQS#_0))
DDR3_BOT_DQS0_P: IC29.Y16(IO,_(DIFFIO_RX_B43p,_DIFFOUT_B43p,_DQS6B,__,_B_DQS_0,_B_DQS_0))
DDR3_BOT_DQS1_N: IC29.Y18(IO,_(DIFFIO_RX_B51n,_DIFFOUT_B51n,_DQSn7B,_DQ2B,_B_DQS#_1,_B_DQS#_1))
DDR3_BOT_DQS1_P: IC29.Y17(IO,_(DIFFIO_RX_B51p,_DIFFOUT_B51p,_DQS7B,_DQ2B,_B_DQS_1,_B_DQS_1))
DDR3_BOT_DQS2_N: IC29.AA20(IO,_(DIFFIO_RX_B59n,_DIFFOUT_B59n,_DQSn8B,_DQSn2B,_B_DQS#_2,_B_DQS#_2))
DDR3_BOT_DQS2_P: IC29.Y20(IO,_(DIFFIO_RX_B59p,_DIFFOUT_B59p,_DQS8B,_DQS2B,_B_DQS_2,_B_DQS_2))
DDR3_BOT_DQS3_N: IC29.AC19(IO,_(DIFFIO_RX_B67n,_DIFFOUT_B67n,_DQSn9B,_DQ3B,_B_DQS#_3,_B_DQS#_3))
DDR3_BOT_DQS3_P: IC29.AB19(IO,_(DIFFIO_RX_B67p,_DIFFOUT_B67p,_DQS9B,_DQ3B,_B_DQS_3,_B_DQS_3))
DDR3_BOT_ODT: IC29.AH14(IO,_(DIFFIO_TX_B44p,_DIFFOUT_B44p,__,__,_B_ODT_0,_B_ODT_0))
DDR3_BOT_RASn: IC29.AG9(IO,_(DIFFIO_TX_B32n,_DIFFOUT_B32n,_DQ4B,_DQ1B,_B_RAS#))
DDR3_BOT_RESETn: IC29.AK21(IO,_(DIFFIO_TX_B60p,_DIFFOUT_B60p,__,__,_B_RESET#,_B_RESET#))
DDR3_BOT_WEn: IC29.AK5(IO,_(DIFFIO_TX_B25p,_DIFFOUT_B25p,_DQ4B,_DQ1B,_B_WE#))
FPGA_SPI1_FLASH_SS_LS: IC29.AB13(IO,_(DIFFIO_RX_B23n,_DIFFOUT_B23n))
FPGA_SPI1_MISO_LS: IC29.AB12(IO,_(DIFFIO_RX_B23p,_DIFFOUT_B23p))
FPGA_SPI1_MOSI_LS: IC29.AG12(IO,_(DIFFIO_RX_B26n,_DIFFOUT_B26n,_DQ4B,_DQ1B,_B_A_15))
FPGA_SPI1_SCLK_LS: IC29.AF13(IO,_(DIFFIO_RX_B26p,_DIFFOUT_B26p,_DQ4B,_DQ1B,_B_A_14))
FPGA_SPI2_LMS_RX_DET_SS: IC29.AJ17(IO,_(DIFFIO_TX_B52p,_DIFFOUT_B52p,__,__,_B_CKE_1,_B_CKE_1))
FPGA_SPI2_SCLK_LS: IC29.AK15(IO,_(DIFFIO_TX_B45n,_DIFFOUT_B45n,_DQ6B,__,_B_ODT_1,_B_ODT_1))
FX3_CTL0: IC29.AA9(IO,_(DIFFIO_TX_B9p,_DIFFOUT_B9p,_DQ2B))
FX3_CTL1: IC29.AB8(IO,_(DIFFIO_TX_B13n,_DIFFOUT_B13n,_DQ2B))
FX3_CTL2: IC29.AC9(IO,_DATA11,_(DIFFIO_TX_B4p,_DIFFOUT_B4p))
FX3_CTL3: IC29.AD9(IO,_DATA9,_(DIFFIO_TX_B4n,_DIFFOUT_B4n,_DQ1B))
FX3_CTL4: IC29.AF8(IO,_(DIFFIO_TX_B12p,_DIFFOUT_B12p))
FX3_CTL5: IC29.AF7(IO,_(DIFFIO_TX_B8p,_DIFFOUT_B8p,_DQ1B))
FX3_CTL6: IC29.AG7(IO,_(DIFFIO_TX_B16p,_DIFFOUT_B16p,_DQ2B))
FX3_CTL7: IC29.AF6(IO,_PR_READY,_(DIFFIO_TX_B8n,_DIFFOUT_B8n,_DQ1B))
FX3_CTL8: IC29.AG6(IO,_(DIFFIO_RX_B10p,_DIFFOUT_B10p,_DQ2B))
FX3_CTL9: IC29.AH7(IO,_(DIFFIO_TX_B16n,_DIFFOUT_B16n,_DQ2B))
FX3_CTL10: IC29.AH6(IO,_(DIFFIO_RX_B10n,_DIFFOUT_B10n,_DQ2B))
FX3_CTL11: IC29.AH4(IO,_(DIFFIO_RX_B14p,_DIFFOUT_B14p,_DQ2B))
FX3_CTL12: IC29.AH5(IO,_(DIFFIO_RX_B14n,_DIFFOUT_B14n,_DQ2B))
FX3_DQ0: IC29.U12(IO,_DATA6,_(DIFFIO_RX_B1n,_DIFFOUT_B1n,_DQ1B))
FX3_DQ1: IC29.U11(IO,_DATA8,_(DIFFIO_RX_B1p,_DIFFOUT_B1p,_DQ1B))
FX3_DQ2: IC29.U8(IO,_(DIFFIO_RX_B11n,_DIFFOUT_B11n,_DQSn2B))
FX3_DQ3: IC29.U9(IO,_(DIFFIO_RX_B15n,_DIFFOUT_B15n))
FX3_DQ4: IC29.T11(IO,_CLKUSR,_(DIFFIO_RX_B5p,_DIFFOUT_B5p,_DQ1B))
FX3_DQ5: IC29.R10(IO,_DATA14,_(DIFFIO_RX_B5n,_DIFFOUT_B5n,_DQ1B))
FX3_DQ6: IC29.T10(IO,_(DIFFIO_RX_B15p,_DIFFOUT_B15p))
FX3_DQ7: IC29.T9(IO,_(DIFFIO_RX_B11p,_DIFFOUT_B11p,_DQS2B))
FX3_DQ8: IC29.V11(IO,_PR_ERROR,_(DIFFIO_RX_B7p,_DIFFOUT_B7p))
FX3_DQ9: IC29.V9(IO,_DATA15,_(DIFFIO_TX_B6p,_DIFFOUT_B6p,_DQ1B))
FX3_DQ10: IC29.V10(IO,_PR_DONE,_(DIFFIO_RX_B7n,_DIFFOUT_B7n))
FX3_DQ11: IC29.W10(IO,_DATA13,_(DIFFIO_TX_B6n,_DIFFOUT_B6n,_DQ1B))
FX3_DQ12: IC29.Y10(IO,_DATA7,_(DIFFIO_TX_B2p,_DIFFOUT_B2p,_DQ1B))
FX3_DQ13: IC29.Y11(IO,_DATA10,_(DIFFIO_RX_B3n,_DIFFOUT_B3n,_DQSn1B))
FX3_DQ14: IC29.AA11(IO,_DATA12,_(DIFFIO_RX_B3p,_DIFFOUT_B3p,_DQS1B))
FX3_DQ15: IC29.AA8(IO,_(DIFFIO_TX_B13p,_DIFFOUT_B13p,_DQ2B))
FX3_FPGA_GPIO0: IC29.AA10(IO,_DATA5,_(DIFFIO_TX_B2n,_DIFFOUT_B2n))
FX3_FPGA_GPIO1: IC29.AB9(IO,_(DIFFIO_TX_B9n,_DIFFOUT_B9n))
FX3_FPGA_GPIO2: IC29.AG8(IO,_(DIFFIO_TX_B12n,_DIFFOUT_B12n,_DQ2B))
FX3_FPGA_GPIO3: IC29.AK3(IO,_(DIFFIO_TX_B21n,_DIFFOUT_B21n,_DQ3B,_DQ1B))
FX3_FPGA_GPIO4: IC29.AJ4(IO,_(DIFFIO_TX_B24p,_DIFFOUT_B24p,_DQ3B,_DQ1B))
FX3_FPGA_GPIO5: IC29.AJ3(IO,_(DIFFIO_TX_B21p,_DIFFOUT_B21p,_DQ3B,_DQ1B))
FX3_PCLK: IC29.AB16(IO,_CLK2p,_(DIFFIO_RX_B47p,_DIFFOUT_B47p))
FX3_SPI_FPGA_SS: IC29.AG22(IO,_(DIFFIO_RX_B78n,_DIFFOUT_B78n,_DQ10B,_DQ3B,_B_DQ_36,_B_DQ_36))
I2C_SCL_LS: IC29.AG23(IO,_(DIFFIO_TX_B80p,_DIFFOUT_B80p,_DQ10B,_DQ3B,_B_DM_4,_B_DM_4))
I2C_SDA_LS: IC29.AH22(IO,_(DIFFIO_TX_B80n,_DIFFOUT_B80n,_DQ10B,_DQ3B,_B_DQ_39,_B_DQ_39))
OCT_RZQIN0: IC29.AK13(IO,_RZQ_0,_(DIFFIO_TX_B41n,_DIFFOUT_B41n)) R154.2
PCIE_SMCLK_LS: IC29.W12(IO,_(DIFFIO_RX_B19n,_DIFFOUT_B19n,_DQSn3B,_DQ1B))
PCIE_SMDAT_LS: IC29.V12(IO,_(DIFFIO_RX_B19p,_DIFFOUT_B19p,_DQS3B,_DQ1B))
PMOD_A_PIN1_LS: IC29.AD12(IO,_(DIFFIO_RX_B18p,_DIFFOUT_B18p,_DQ3B,_DQ1B))
PMOD_A_PIN2_LS: IC29.AE10(IO,_(DIFFIO_TX_B17p,_DIFFOUT_B17p,_DQ3B,_DQ1B))
PMOD_A_PIN3_LS: IC29.AF10(IO,_(DIFFIO_TX_B17n,_DIFFOUT_B17n))
PMOD_A_PIN4_LS: IC29.AD13(IO,_(DIFFIO_RX_B18n,_DIFFOUT_B18n,_DQ3B,_DQ1B))
PMOD_A_PIN7_LS: IC29.AE12(IO,_(DIFFIO_RX_B22p,_DIFFOUT_B22p,_DQ3B,_DQ1B))
PMOD_A_PIN8_LS: IC29.AE13(IO,_(DIFFIO_RX_B22n,_DIFFOUT_B22n,_DQ3B,_DQ1B))
PMOD_A_PIN9_LS: IC29.AJ2(IO,_(DIFFIO_TX_B20n,_DIFFOUT_B20n,_DQ3B,_DQ1B))
PMOD_A_PIN10_LS: IC29.AJ1(IO,_(DIFFIO_TX_B20p,_DIFFOUT_B20p))
PMOD_B_PIN1_LS: IC29.AF20(IO,_(DIFFIO_RX_B74p,_DIFFOUT_B74p,_DQ10B,_DQ3B,_B_DQ_33,_B_DQ_33))
PMOD_B_PIN2_LS: IC29.AG21(IO,_(DIFFIO_RX_B74n,_DIFFOUT_B74n,_DQ10B,_DQ3B,_B_DQ_32,_B_DQ_32))
PMOD_B_PIN3_LS: IC29.AF21(IO,_(DIFFIO_RX_B78p,_DIFFOUT_B78p,_DQ10B,_DQ3B,_B_DQ_37,_B_DQ_37))
PMOD_B_PIN4_LS: IC29.AD20(IO,_(DIFFIO_RX_B75n,_DIFFOUT_B75n,_DQSn10B,_DQSn3B,_B_DQS#_4,_B_DQS#_4))
PMOD_B_PIN7_LS: IC29.AK27(IO,_(DIFFIO_TX_B73p,_DIFFOUT_B73p,_DQ10B,_DQ3B,_B_DQ_34,_B_DQ_34))
PMOD_B_PIN8_LS: IC29.AE22(IO,_(DIFFIO_TX_B77p,_DIFFOUT_B77p,_DQ10B,_DQ3B,_B_DQ_38,_B_DQ_38))
PMOD_B_PIN9_LS: IC29.AC21(IO,_(DIFFIO_RX_B75p,_DIFFOUT_B75p,_DQS10B,_DQS3B,_B_DQS_4,_B_DQS_4))
PMOD_B_PIN10_LS: IC29.AH26(IO,_(DIFFIO_TX_B76n,_DIFFOUT_B76n,_DQ10B,_DQ3B,_B_DQ_35,_B_DQ_35))
SI_CLK6: IC29.AB18(IO,_CLK3n,_(DIFFIO_RX_B55n,_DIFFOUT_B55n))
SI_CLK7: IC29.AC15(IO,_CLK2n,_(DIFFIO_RX_B47n,_DIFFOUT_B47n))
SR_DIN_LS: IC29.AJ5(IO,_(DIFFIO_TX_B24n,_DIFFOUT_B24n,_DQ3B,_DQ1B))
SR_SCLK_LS: IC29.AA13(IO,_(DIFFIO_RX_B27n,_DIFFOUT_B27n,_DQSn4B,_DQSn1B,_B_CS#_1,_B_CS#_1))

Not connected (* = marked no-connect by the designer): FL3 1*; FL4 1*; IC29 AA15(IO,_CLK1n,_(DIFFIO_RX_B39n,_DIFFOUT_B39n))*

### Notes on the sheet
- NF elements on sheet: -
- Number of NF elements on sheet: 0
- FPGA banks 3A, 3B, 4A
- VCC1P5
- VCC1P8
- (near FL3) Local FPGA + DDR "BOTTOM" fiducial Top
- (near FL4) Local FPGA + DDR "TOP" fiducial Top
- Project name:
- Title:
- Size:
- Date:
- A3
- Revision:
- Time:
- Sheet
- of
- File:
- (in symbol 5CGXFC7D7F31C8N, part A) BANK 3A
- (in symbol 5CGXFC7D7F31C8N, part B) BANK 3B
- (in symbol 5CGXFC7D7F31C8N, part C) BANK 4A

### Library data of the parts
IC29 = 5CGXFC7D7F31C8N: Cyclone V GX Family FPGA, 1.07 to 1.13 V Supply, 480 I/O Pins, 7 PLLs, 896-Pin FBGA, Speed Grade 8, Commercial Grade, RoHS Compliant; Manufacturer: Altera; Part Description: IC FPGA 480 I/O 896FBGA; GPIO: 480; Logic Elements (LE) (K): 149.5; Speed Grade: 8; DatasheetVersion: Rev. 3.4; PackageVersion: Rev. 2.0, 12/2012; PackageReference: FBGA896_A-200; PackageDescription: 896-Pin FineLine Ball-Grid Array (FBGA), Body 31 x 31 mm, Pitch 1 mm; Supplier 1: Digi-Key; Supplier Part Number 1: 544-2772-ND; Supplier 2: Mouser; Supplier Part Number 2: 989-5CGXFC7D7F31C8N; Device Group: 5CGXFC7; RoHS: RoHS Compliant; Subcategory: Cyclone V GX; Voltage Supply: 1.07 to 1.13 V; NexusDeviceID: 5CGXFC7D7F31C8N; Mounting Technology: Surface Mount; Code_JEDEC: MS-034-AAN-1; PartNumber: 5CGXFC7D7F31C8N; ComponentLink1Description: Manufacturer URL; ComponentLink1URL: http://www.altera.com; ComponentLink2Description: Datasheet; ComponentLink2URL: http://www.altera.com/literature/hb/cyclone-v/cv_51002.pdf; ComponentLink3Description: Package Specification; ComponentLink3URL: http://www.altera.com/devicepackaging/04R00435-01.pdf; ComponentLink4Description: Device Handbook URL; ComponentLink4URL: http://www.altera.com/literature/hb/cyclone-v/cyclone5_handbook.pdf; ComponentLink5Description: Device Pin-Out URL; ComponentLink5URL: http://www.altera.com/literature/dp/cyclone-v/5CGXFC7.xls; ComponentLink6Description: Device Overview URL; ComponentLink6URL: http://www.altera.com/literature/hb/cyclone-v/cv_51001.pdf; ComponentLink7Description: Product URL; ComponentLink7URL: http://www.buyaltera.com/scripts/partsearch.dll?Detail&name=5CGXFC7D7F31C8N-ND
R154 = Res_0402: Manufacturer Part Number 1: RMCF0402FT100R; Part Description: RES SMD 100 OHM 1% 1/16W 0402; Manufacturer: Stackpole Electronics Inc.; Temperature Coefficient: ±100ppm/°C; Supplier 1: Digi-Key; Supplier Part Number 1: RMCF0402FT100RDKR-ND; Package / Case: 0402 (1005 Metric); Composition: Thick Film; Category: Resistors; Tolerance: ±1%; Value: 100R, 1%

## Sheet 13_FPGA_banks_5A_5B_6A.SchDoc: FPGA banks 5A, 5B, 6A
size A3; Organization: Lime Microsystems; Address1: Surrey Tech Centre; Address2: Guildford GU2 7YG; Address3: Surrey; Address4: United Kingdom; Revision: v1.2; SheetNumber: 11; SheetTotal: 27
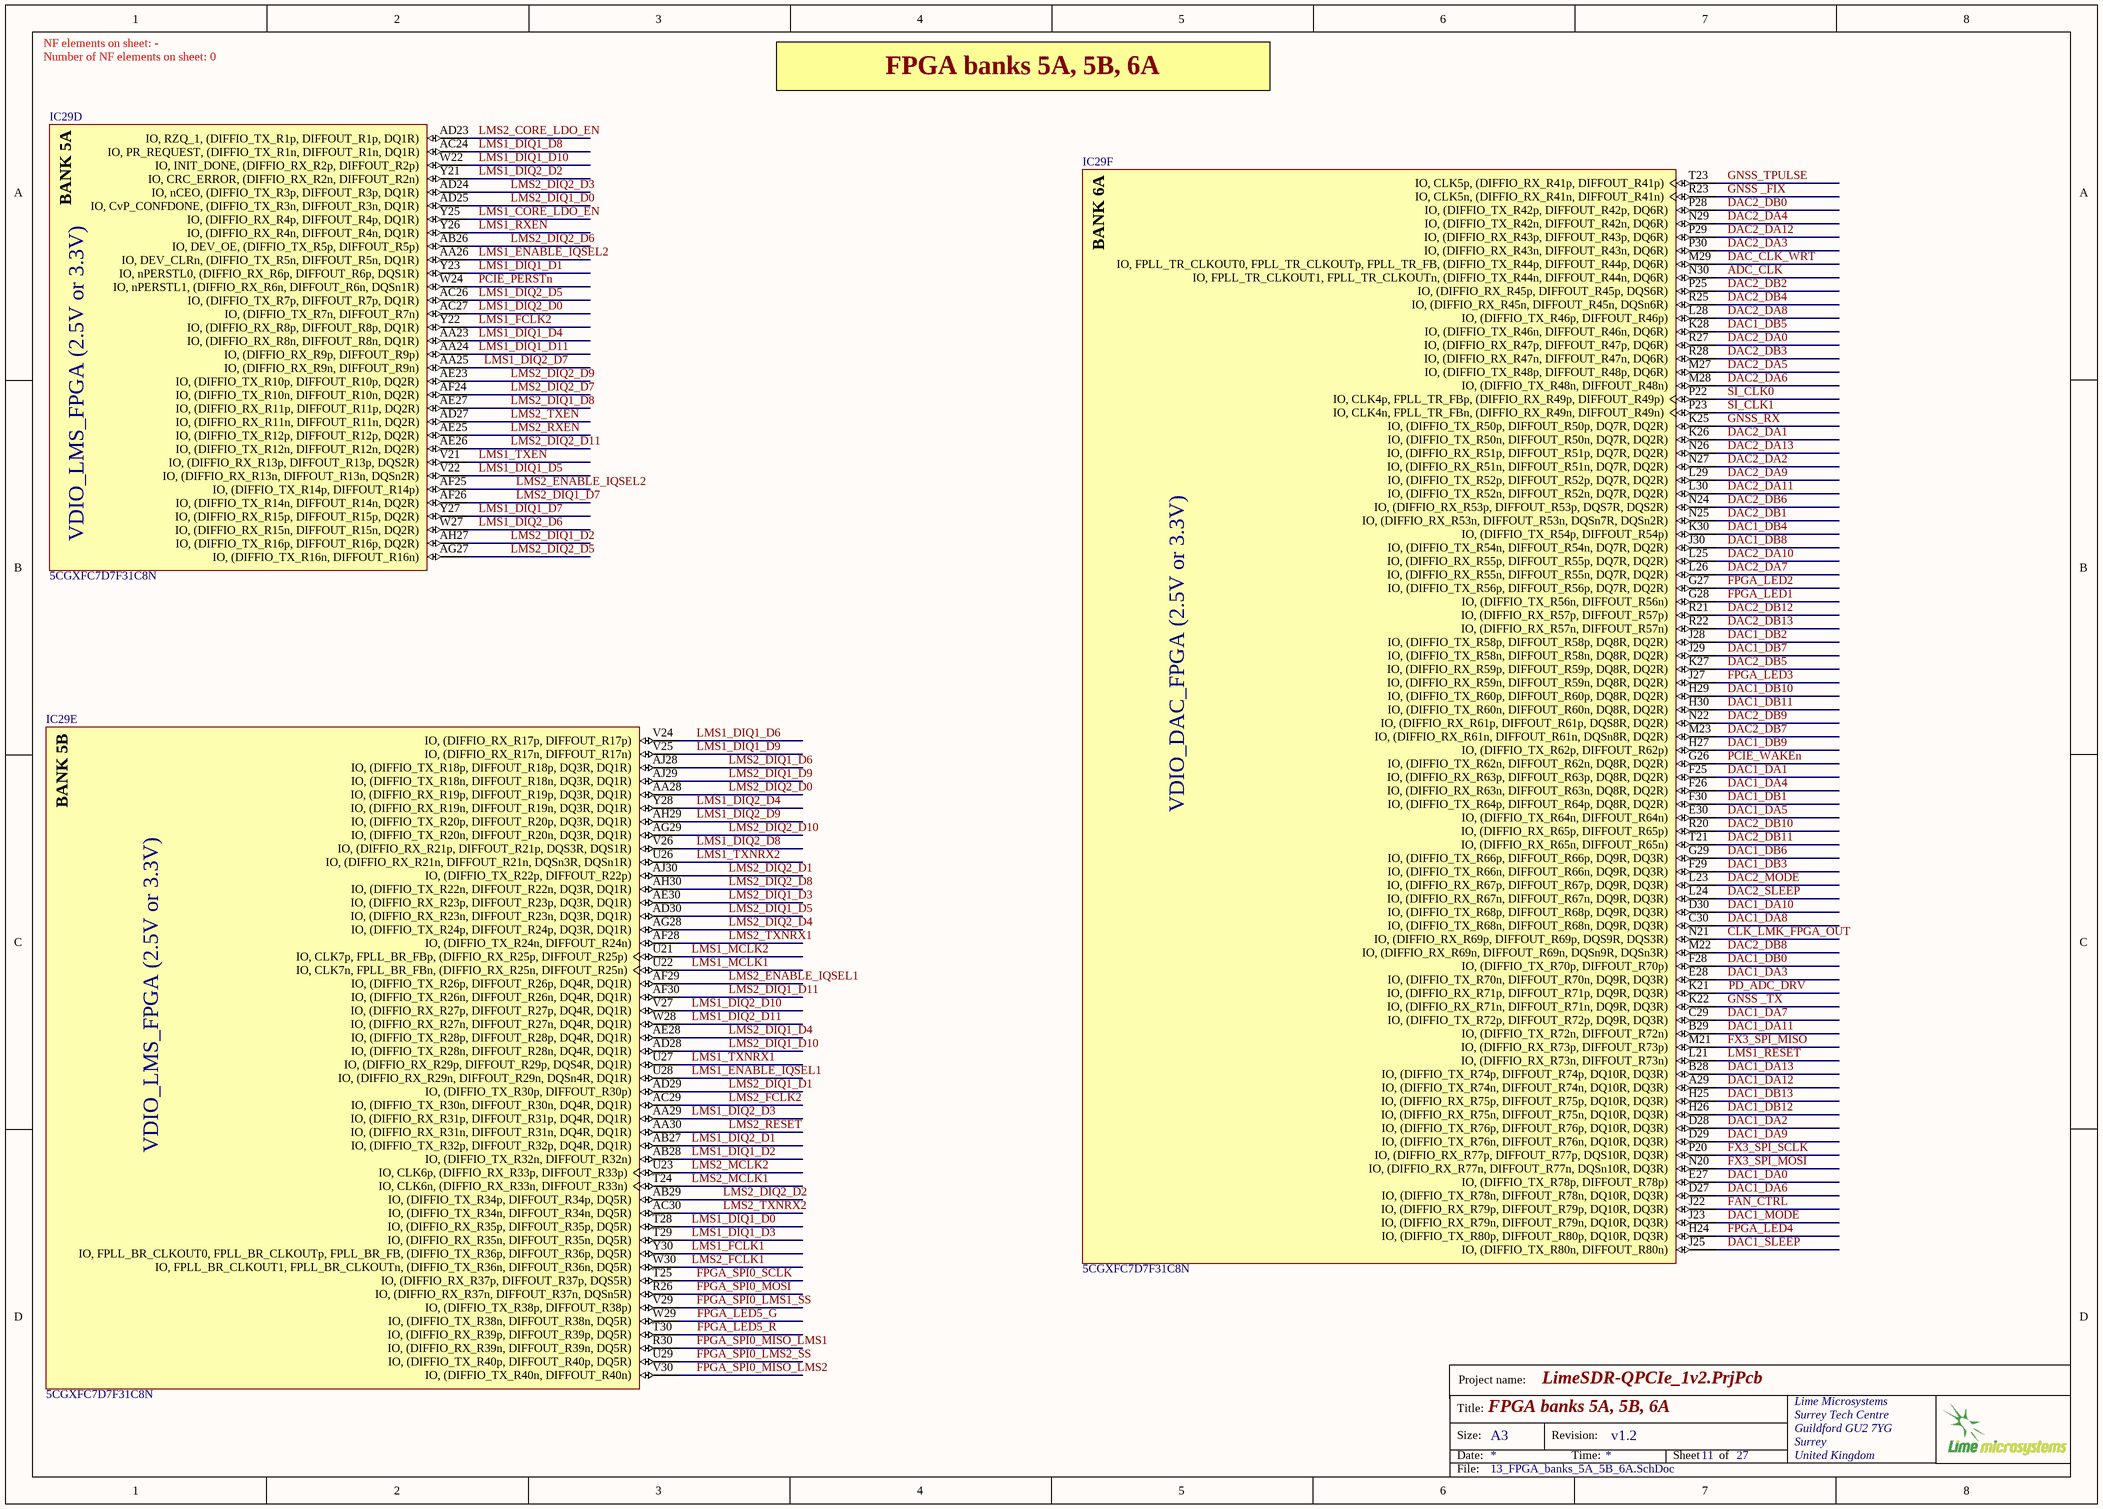
[diagram p12: 13_FPGA_banks_5A_5B_6A.SchDoc]

### Parts
IC29  5CGXFC7D7F31C8N  [ALTR-FBGA896_A-200]  (parts D,E,F of 16)

### Nets
ADC_CLK: IC29.N30(IO,_FPLL_TR_CLKOUT1,_FPLL_TR_CLKOUTn,_(DIFFIO_TX_R44n,_DIFFOUT_R44n,_DQ6R))
CLK_LMK_FPGA_OUT: IC29.N21(IO,_(DIFFIO_RX_R69p,_DIFFOUT_R69p,_DQS9R,_DQS3R))
DAC1_DA0: IC29.E27(IO,_(DIFFIO_TX_R78p,_DIFFOUT_R78p))
DAC1_DA1: IC29.F25(IO,_(DIFFIO_RX_R63p,_DIFFOUT_R63p,_DQ8R,_DQ2R))
DAC1_DA2: IC29.D28(IO,_(DIFFIO_TX_R76p,_DIFFOUT_R76p,_DQ10R,_DQ3R))
DAC1_DA3: IC29.E28(IO,_(DIFFIO_TX_R70n,_DIFFOUT_R70n,_DQ9R,_DQ3R))
DAC1_DA4: IC29.F26(IO,_(DIFFIO_RX_R63n,_DIFFOUT_R63n,_DQ8R,_DQ2R))
DAC1_DA5: IC29.E30(IO,_(DIFFIO_TX_R64n,_DIFFOUT_R64n))
DAC1_DA6: IC29.D27(IO,_(DIFFIO_TX_R78n,_DIFFOUT_R78n,_DQ10R,_DQ3R))
DAC1_DA7: IC29.C29(IO,_(DIFFIO_TX_R72p,_DIFFOUT_R72p,_DQ9R,_DQ3R))
DAC1_DA8: IC29.C30(IO,_(DIFFIO_TX_R68n,_DIFFOUT_R68n,_DQ9R,_DQ3R))
DAC1_DA9: IC29.D29(IO,_(DIFFIO_TX_R76n,_DIFFOUT_R76n,_DQ10R,_DQ3R))
DAC1_DA10: IC29.D30(IO,_(DIFFIO_TX_R68p,_DIFFOUT_R68p,_DQ9R,_DQ3R))
DAC1_DA11: IC29.B29(IO,_(DIFFIO_TX_R72n,_DIFFOUT_R72n))
DAC1_DA12: IC29.A29(IO,_(DIFFIO_TX_R74n,_DIFFOUT_R74n,_DQ10R,_DQ3R))
DAC1_DA13: IC29.B28(IO,_(DIFFIO_TX_R74p,_DIFFOUT_R74p,_DQ10R,_DQ3R))
DAC1_DB0: IC29.F28(IO,_(DIFFIO_TX_R70p,_DIFFOUT_R70p))
DAC1_DB1: IC29.F30(IO,_(DIFFIO_TX_R64p,_DIFFOUT_R64p,_DQ8R,_DQ2R))
DAC1_DB2: IC29.J28(IO,_(DIFFIO_TX_R58p,_DIFFOUT_R58p,_DQ8R,_DQ2R))
DAC1_DB3: IC29.F29(IO,_(DIFFIO_TX_R66n,_DIFFOUT_R66n,_DQ9R,_DQ3R))
DAC1_DB4: IC29.K30(IO,_(DIFFIO_TX_R54p,_DIFFOUT_R54p))
DAC1_DB5: IC29.K28(IO,_(DIFFIO_TX_R46n,_DIFFOUT_R46n,_DQ6R))
DAC1_DB6: IC29.G29(IO,_(DIFFIO_TX_R66p,_DIFFOUT_R66p,_DQ9R,_DQ3R))
DAC1_DB7: IC29.J29(IO,_(DIFFIO_TX_R58n,_DIFFOUT_R58n,_DQ8R,_DQ2R))
DAC1_DB8: IC29.J30(IO,_(DIFFIO_TX_R54n,_DIFFOUT_R54n,_DQ7R,_DQ2R))
DAC1_DB9: IC29.H27(IO,_(DIFFIO_TX_R62p,_DIFFOUT_R62p))
DAC1_DB10: IC29.H29(IO,_(DIFFIO_TX_R60p,_DIFFOUT_R60p,_DQ8R,_DQ2R))
DAC1_DB11: IC29.H30(IO,_(DIFFIO_TX_R60n,_DIFFOUT_R60n,_DQ8R,_DQ2R))
DAC1_DB12: IC29.H26(IO,_(DIFFIO_RX_R75n,_DIFFOUT_R75n,_DQ10R,_DQ3R))
DAC1_DB13: IC29.H25(IO,_(DIFFIO_RX_R75p,_DIFFOUT_R75p,_DQ10R,_DQ3R))
DAC1_MODE: IC29.J23(IO,_(DIFFIO_RX_R79n,_DIFFOUT_R79n,_DQ10R,_DQ3R))
DAC1_SLEEP: IC29.J25(IO,_(DIFFIO_TX_R80n,_DIFFOUT_R80n))
DAC2_DA0: IC29.R27(IO,_(DIFFIO_RX_R47p,_DIFFOUT_R47p,_DQ6R))
DAC2_DA1: IC29.K26(IO,_(DIFFIO_TX_R50n,_DIFFOUT_R50n,_DQ7R,_DQ2R))
DAC2_DA2: IC29.N27(IO,_(DIFFIO_RX_R51n,_DIFFOUT_R51n,_DQ7R,_DQ2R))
DAC2_DA3: IC29.P30(IO,_(DIFFIO_RX_R43n,_DIFFOUT_R43n,_DQ6R))
DAC2_DA4: IC29.N29(IO,_(DIFFIO_TX_R42n,_DIFFOUT_R42n,_DQ6R))
DAC2_DA5: IC29.M27(IO,_(DIFFIO_TX_R48p,_DIFFOUT_R48p,_DQ6R))
DAC2_DA6: IC29.M28(IO,_(DIFFIO_TX_R48n,_DIFFOUT_R48n))
DAC2_DA7: IC29.L26(IO,_(DIFFIO_RX_R55n,_DIFFOUT_R55n,_DQ7R,_DQ2R))
DAC2_DA8: IC29.L28(IO,_(DIFFIO_TX_R46p,_DIFFOUT_R46p))
DAC2_DA9: IC29.L29(IO,_(DIFFIO_TX_R52p,_DIFFOUT_R52p,_DQ7R,_DQ2R))
DAC2_DA10: IC29.L25(IO,_(DIFFIO_RX_R55p,_DIFFOUT_R55p,_DQ7R,_DQ2R))
DAC2_DA11: IC29.L30(IO,_(DIFFIO_TX_R52n,_DIFFOUT_R52n,_DQ7R,_DQ2R))
DAC2_DA12: IC29.P29(IO,_(DIFFIO_RX_R43p,_DIFFOUT_R43p,_DQ6R))
DAC2_DA13: IC29.N26(IO,_(DIFFIO_RX_R51p,_DIFFOUT_R51p,_DQ7R,_DQ2R))
DAC2_DB0: IC29.P28(IO,_(DIFFIO_TX_R42p,_DIFFOUT_R42p,_DQ6R))
DAC2_DB1: IC29.N25(IO,_(DIFFIO_RX_R53n,_DIFFOUT_R53n,_DQSn7R,_DQSn2R))
DAC2_DB2: IC29.P25(IO,_(DIFFIO_RX_R45p,_DIFFOUT_R45p,_DQS6R))
DAC2_DB3: IC29.R28(IO,_(DIFFIO_RX_R47n,_DIFFOUT_R47n,_DQ6R))
DAC2_DB4: IC29.R25(IO,_(DIFFIO_RX_R45n,_DIFFOUT_R45n,_DQSn6R))
DAC2_DB5: IC29.K27(IO,_(DIFFIO_RX_R59p,_DIFFOUT_R59p,_DQ8R,_DQ2R))
DAC2_DB6: IC29.N24(IO,_(DIFFIO_RX_R53p,_DIFFOUT_R53p,_DQS7R,_DQS2R))
DAC2_DB7: IC29.M23(IO,_(DIFFIO_RX_R61n,_DIFFOUT_R61n,_DQSn8R,_DQ2R))
DAC2_DB8: IC29.M22(IO,_(DIFFIO_RX_R69n,_DIFFOUT_R69n,_DQSn9R,_DQSn3R))
DAC2_DB9: IC29.N22(IO,_(DIFFIO_RX_R61p,_DIFFOUT_R61p,_DQS8R,_DQ2R))
DAC2_DB10: IC29.R20(IO,_(DIFFIO_RX_R65p,_DIFFOUT_R65p))
DAC2_DB11: IC29.T21(IO,_(DIFFIO_RX_R65n,_DIFFOUT_R65n))
DAC2_DB12: IC29.R21(IO,_(DIFFIO_RX_R57p,_DIFFOUT_R57p))
DAC2_DB13: IC29.R22(IO,_(DIFFIO_RX_R57n,_DIFFOUT_R57n))
DAC2_MODE: IC29.L23(IO,_(DIFFIO_RX_R67p,_DIFFOUT_R67p,_DQ9R,_DQ3R))
DAC2_SLEEP: IC29.L24(IO,_(DIFFIO_RX_R67n,_DIFFOUT_R67n,_DQ9R,_DQ3R))
DAC_CLK_WRT: IC29.M29(IO,_FPLL_TR_CLKOUT0,_FPLL_TR_CLKOUTp,_FPLL_TR_FB,_(DIFFIO_TX_R44p,_DIFFOUT_R44p,_DQ6R))
FAN_CTRL: IC29.J22(IO,_(DIFFIO_RX_R79p,_DIFFOUT_R79p,_DQ10R,_DQ3R))
FPGA_LED1: IC29.G28(IO,_(DIFFIO_TX_R56n,_DIFFOUT_R56n))
FPGA_LED2: IC29.G27(IO,_(DIFFIO_TX_R56p,_DIFFOUT_R56p,_DQ7R,_DQ2R))
FPGA_LED3: IC29.J27(IO,_(DIFFIO_RX_R59n,_DIFFOUT_R59n,_DQ8R,_DQ2R))
FPGA_LED4: IC29.H24(IO,_(DIFFIO_TX_R80p,_DIFFOUT_R80p,_DQ10R,_DQ3R))
FPGA_LED5_G: IC29.W29(IO,_(DIFFIO_TX_R38n,_DIFFOUT_R38n,_DQ5R))
FPGA_LED5_R: IC29.T30(IO,_(DIFFIO_RX_R39p,_DIFFOUT_R39p,_DQ5R))
FPGA_SPI0_LMS1_SS: IC29.V29(IO,_(DIFFIO_TX_R38p,_DIFFOUT_R38p))
FPGA_SPI0_LMS2_SS: IC29.U29(IO,_(DIFFIO_TX_R40p,_DIFFOUT_R40p,_DQ5R))
FPGA_SPI0_MISO_LMS1: IC29.R30(IO,_(DIFFIO_RX_R39n,_DIFFOUT_R39n,_DQ5R))
FPGA_SPI0_MISO_LMS2: IC29.V30(IO,_(DIFFIO_TX_R40n,_DIFFOUT_R40n))
FPGA_SPI0_MOSI: IC29.R26(IO,_(DIFFIO_RX_R37n,_DIFFOUT_R37n,_DQSn5R))
FPGA_SPI0_SCLK: IC29.T25(IO,_(DIFFIO_RX_R37p,_DIFFOUT_R37p,_DQS5R))
FX3_SPI_MISO: IC29.M21(IO,_(DIFFIO_RX_R73p,_DIFFOUT_R73p))
FX3_SPI_MOSI: IC29.N20(IO,_(DIFFIO_RX_R77n,_DIFFOUT_R77n,_DQSn10R,_DQ3R))
FX3_SPI_SCLK: IC29.P20(IO,_(DIFFIO_RX_R77p,_DIFFOUT_R77p,_DQS10R,_DQ3R))
GNSS _FIX: IC29.R23(IO,_CLK5n,_(DIFFIO_RX_R41n,_DIFFOUT_R41n))
GNSS _TX: IC29.K22(IO,_(DIFFIO_RX_R71n,_DIFFOUT_R71n,_DQ9R,_DQ3R))
GNSS_RX: IC29.K25(IO,_(DIFFIO_TX_R50p,_DIFFOUT_R50p,_DQ7R,_DQ2R))
GNSS_TPULSE: IC29.T23(IO,_CLK5p,_(DIFFIO_RX_R41p,_DIFFOUT_R41p))
LMS1_CORE_LDO_EN: IC29.Y25(IO,_(DIFFIO_RX_R4p,_DIFFOUT_R4p,_DQ1R))
LMS1_DIQ1_D0: IC29.T28(IO,_(DIFFIO_RX_R35p,_DIFFOUT_R35p,_DQ5R))
LMS1_DIQ1_D1: IC29.Y23(IO,_nPERSTL0,_(DIFFIO_RX_R6p,_DIFFOUT_R6p,_DQS1R))
LMS1_DIQ1_D2: IC29.AB28(IO,_(DIFFIO_TX_R32n,_DIFFOUT_R32n))
LMS1_DIQ1_D3: IC29.T29(IO,_(DIFFIO_RX_R35n,_DIFFOUT_R35n,_DQ5R))
LMS1_DIQ1_D4: IC29.AA23(IO,_(DIFFIO_RX_R8n,_DIFFOUT_R8n,_DQ1R))
LMS1_DIQ1_D5: IC29.V22(IO,_(DIFFIO_RX_R13n,_DIFFOUT_R13n,_DQSn2R))
LMS1_DIQ1_D6: IC29.V24(IO,_(DIFFIO_RX_R17p,_DIFFOUT_R17p))
LMS1_DIQ1_D7: IC29.Y27(IO,_(DIFFIO_RX_R15p,_DIFFOUT_R15p,_DQ2R))
LMS1_DIQ1_D8: IC29.AC24(IO,_PR_REQUEST,_(DIFFIO_TX_R1n,_DIFFOUT_R1n,_DQ1R))
LMS1_DIQ1_D9: IC29.V25(IO,_(DIFFIO_RX_R17n,_DIFFOUT_R17n))
LMS1_DIQ1_D10: IC29.W22(IO,_INIT_DONE,_(DIFFIO_RX_R2p,_DIFFOUT_R2p))
LMS1_DIQ1_D11: IC29.AA24(IO,_(DIFFIO_RX_R9p,_DIFFOUT_R9p))
LMS1_DIQ2_D0: IC29.AC27(IO,_(DIFFIO_TX_R7n,_DIFFOUT_R7n))
LMS1_DIQ2_D1: IC29.AB27(IO,_(DIFFIO_TX_R32p,_DIFFOUT_R32p,_DQ4R,_DQ1R))
LMS1_DIQ2_D2: IC29.Y21(IO,_CRC_ERROR,_(DIFFIO_RX_R2n,_DIFFOUT_R2n))
LMS1_DIQ2_D3: IC29.AA29(IO,_(DIFFIO_RX_R31p,_DIFFOUT_R31p,_DQ4R,_DQ1R))
LMS1_DIQ2_D4: IC29.Y28(IO,_(DIFFIO_RX_R19n,_DIFFOUT_R19n,_DQ3R,_DQ1R))
LMS1_DIQ2_D5: IC29.AC26(IO,_(DIFFIO_TX_R7p,_DIFFOUT_R7p,_DQ1R))
LMS1_DIQ2_D6: IC29.W27(IO,_(DIFFIO_RX_R15n,_DIFFOUT_R15n,_DQ2R))
LMS1_DIQ2_D7: IC29.AA25(IO,_(DIFFIO_RX_R9n,_DIFFOUT_R9n))
LMS1_DIQ2_D8: IC29.V26(IO,_(DIFFIO_RX_R21p,_DIFFOUT_R21p,_DQS3R,_DQS1R))
LMS1_DIQ2_D9: IC29.AH29(IO,_(DIFFIO_TX_R20p,_DIFFOUT_R20p,_DQ3R,_DQ1R))
LMS1_DIQ2_D10: IC29.V27(IO,_(DIFFIO_RX_R27p,_DIFFOUT_R27p,_DQ4R,_DQ1R))
LMS1_DIQ2_D11: IC29.W28(IO,_(DIFFIO_RX_R27n,_DIFFOUT_R27n,_DQ4R,_DQ1R))
LMS1_ENABLE_IQSEL1: IC29.U28(IO,_(DIFFIO_RX_R29n,_DIFFOUT_R29n,_DQSn4R,_DQ1R))
LMS1_ENABLE_IQSEL2: IC29.AA26(IO,_DEV_CLRn,_(DIFFIO_TX_R5n,_DIFFOUT_R5n,_DQ1R))
LMS1_FCLK1: IC29.Y30(IO,_FPLL_BR_CLKOUT0,_FPLL_BR_CLKOUTp,_FPLL_BR_FB,_(DIFFIO_TX_R36p,_DIFFOUT_R36p,_DQ5R))
LMS1_FCLK2: IC29.Y22(IO,_(DIFFIO_RX_R8p,_DIFFOUT_R8p,_DQ1R))
LMS1_MCLK1: IC29.U22(IO,_CLK7n,_FPLL_BR_FBn,_(DIFFIO_RX_R25n,_DIFFOUT_R25n))
LMS1_MCLK2: IC29.U21(IO,_CLK7p,_FPLL_BR_FBp,_(DIFFIO_RX_R25p,_DIFFOUT_R25p))
LMS1_RESET: IC29.L21(IO,_(DIFFIO_RX_R73n,_DIFFOUT_R73n))
LMS1_RXEN: IC29.Y26(IO,_(DIFFIO_RX_R4n,_DIFFOUT_R4n,_DQ1R))
LMS1_TXEN: IC29.V21(IO,_(DIFFIO_RX_R13p,_DIFFOUT_R13p,_DQS2R))
LMS1_TXNRX1: IC29.U27(IO,_(DIFFIO_RX_R29p,_DIFFOUT_R29p,_DQS4R,_DQ1R))
LMS1_TXNRX2: IC29.U26(IO,_(DIFFIO_RX_R21n,_DIFFOUT_R21n,_DQSn3R,_DQSn1R))
LMS2_CORE_LDO_EN: IC29.AD23(IO,_RZQ_1,_(DIFFIO_TX_R1p,_DIFFOUT_R1p,_DQ1R))
LMS2_DIQ1_D0: IC29.AD25(IO,_CvP_CONFDONE,_(DIFFIO_TX_R3n,_DIFFOUT_R3n,_DQ1R))
LMS2_DIQ1_D1: IC29.AD29(IO,_(DIFFIO_TX_R30p,_DIFFOUT_R30p))
LMS2_DIQ1_D2: IC29.AH27(IO,_(DIFFIO_TX_R16p,_DIFFOUT_R16p,_DQ2R))
LMS2_DIQ1_D3: IC29.AE30(IO,_(DIFFIO_RX_R23p,_DIFFOUT_R23p,_DQ3R,_DQ1R))
LMS2_DIQ1_D4: IC29.AE28(IO,_(DIFFIO_TX_R28p,_DIFFOUT_R28p,_DQ4R,_DQ1R))
LMS2_DIQ1_D5: IC29.AD30(IO,_(DIFFIO_RX_R23n,_DIFFOUT_R23n,_DQ3R,_DQ1R))
LMS2_DIQ1_D6: IC29.AJ28(IO,_(DIFFIO_TX_R18p,_DIFFOUT_R18p,_DQ3R,_DQ1R))
LMS2_DIQ1_D7: IC29.AF26(IO,_(DIFFIO_TX_R14n,_DIFFOUT_R14n,_DQ2R))
LMS2_DIQ1_D8: IC29.AE27(IO,_(DIFFIO_RX_R11p,_DIFFOUT_R11p,_DQ2R))
LMS2_DIQ1_D9: IC29.AJ29(IO,_(DIFFIO_TX_R18n,_DIFFOUT_R18n,_DQ3R,_DQ1R))
LMS2_DIQ1_D10: IC29.AD28(IO,_(DIFFIO_TX_R28n,_DIFFOUT_R28n,_DQ4R,_DQ1R))
LMS2_DIQ1_D11: IC29.AF30(IO,_(DIFFIO_TX_R26n,_DIFFOUT_R26n,_DQ4R,_DQ1R))
LMS2_DIQ2_D0: IC29.AA28(IO,_(DIFFIO_RX_R19p,_DIFFOUT_R19p,_DQ3R,_DQ1R))
LMS2_DIQ2_D1: IC29.AJ30(IO,_(DIFFIO_TX_R22p,_DIFFOUT_R22p))
LMS2_DIQ2_D2: IC29.AB29(IO,_(DIFFIO_TX_R34p,_DIFFOUT_R34p,_DQ5R))
LMS2_DIQ2_D3: IC29.AD24(IO,_nCEO,_(DIFFIO_TX_R3p,_DIFFOUT_R3p,_DQ1R))
LMS2_DIQ2_D4: IC29.AG28(IO,_(DIFFIO_TX_R24p,_DIFFOUT_R24p,_DQ3R,_DQ1R))
LMS2_DIQ2_D5: IC29.AG27(IO,_(DIFFIO_TX_R16n,_DIFFOUT_R16n))
LMS2_DIQ2_D6: IC29.AB26(IO,_DEV_OE,_(DIFFIO_TX_R5p,_DIFFOUT_R5p))
LMS2_DIQ2_D7: IC29.AF24(IO,_(DIFFIO_TX_R10n,_DIFFOUT_R10n,_DQ2R))
LMS2_DIQ2_D8: IC29.AH30(IO,_(DIFFIO_TX_R22n,_DIFFOUT_R22n,_DQ3R,_DQ1R))
LMS2_DIQ2_D9: IC29.AE23(IO,_(DIFFIO_TX_R10p,_DIFFOUT_R10p,_DQ2R))
LMS2_DIQ2_D10: IC29.AG29(IO,_(DIFFIO_TX_R20n,_DIFFOUT_R20n,_DQ3R,_DQ1R))
LMS2_DIQ2_D11: IC29.AE26(IO,_(DIFFIO_TX_R12n,_DIFFOUT_R12n,_DQ2R))
LMS2_ENABLE_IQSEL1: IC29.AF29(IO,_(DIFFIO_TX_R26p,_DIFFOUT_R26p,_DQ4R,_DQ1R))
LMS2_ENABLE_IQSEL2: IC29.AF25(IO,_(DIFFIO_TX_R14p,_DIFFOUT_R14p))
LMS2_FCLK1: IC29.W30(IO,_FPLL_BR_CLKOUT1,_FPLL_BR_CLKOUTn,_(DIFFIO_TX_R36n,_DIFFOUT_R36n,_DQ5R))
LMS2_FCLK2: IC29.AC29(IO,_(DIFFIO_TX_R30n,_DIFFOUT_R30n,_DQ4R,_DQ1R))
LMS2_MCLK1: IC29.T24(IO,_CLK6n,_(DIFFIO_RX_R33n,_DIFFOUT_R33n))
LMS2_MCLK2: IC29.U23(IO,_CLK6p,_(DIFFIO_RX_R33p,_DIFFOUT_R33p))
LMS2_RESET: IC29.AA30(IO,_(DIFFIO_RX_R31n,_DIFFOUT_R31n,_DQ4R,_DQ1R))
LMS2_RXEN: IC29.AE25(IO,_(DIFFIO_TX_R12p,_DIFFOUT_R12p,_DQ2R))
LMS2_TXEN: IC29.AD27(IO,_(DIFFIO_RX_R11n,_DIFFOUT_R11n,_DQ2R))
LMS2_TXNRX1: IC29.AF28(IO,_(DIFFIO_TX_R24n,_DIFFOUT_R24n))
LMS2_TXNRX2: IC29.AC30(IO,_(DIFFIO_TX_R34n,_DIFFOUT_R34n,_DQ5R))
PCIE_PERSTn: IC29.W24(IO,_nPERSTL1,_(DIFFIO_RX_R6n,_DIFFOUT_R6n,_DQSn1R))
PCIE_WAKEn: IC29.G26(IO,_(DIFFIO_TX_R62n,_DIFFOUT_R62n,_DQ8R,_DQ2R))
PD_ADC_DRV: IC29.K21(IO,_(DIFFIO_RX_R71p,_DIFFOUT_R71p,_DQ9R,_DQ3R))
SI_CLK0: IC29.P22(IO,_CLK4p,_FPLL_TR_FBp,_(DIFFIO_RX_R49p,_DIFFOUT_R49p))
SI_CLK1: IC29.P23(IO,_CLK4n,_FPLL_TR_FBn,_(DIFFIO_RX_R49n,_DIFFOUT_R49n))

### Notes on the sheet
- NF elements on sheet: -
- Number of NF elements on sheet: 0
- FPGA banks 5A, 5B, 6A
- VDIO_LMS_FPGA (2.5V or 3.3V)
- VDIO_DAC_FPGA (2.5V or 3.3V)
- Project name:
- Title:
- Size:
- Date:
- A3
- Revision:
- Time:
- Sheet
- of
- File:
- (in symbol 5CGXFC7D7F31C8N, part D) BANK 5A
- (in symbol 5CGXFC7D7F31C8N, part E) BANK 5B
- (in symbol 5CGXFC7D7F31C8N, part F) BANK 6A

### Library data of the parts
IC29 = 5CGXFC7D7F31C8N: as IC29 on sheet 12_FPGA_banks_3A_3B_4A; DatasheetVersion: Rev. 3.4; PackageVersion: Rev. 2.0, 12/2012; PackageReference: FBGA896_A-200; PackageDescription: 896-Pin FineLine Ball-Grid Array (FBGA), Body 31 x 31 mm, Pitch 1 mm; Supplier 1: Digi-Key; Supplier Part Number 1: 544-2772-ND; Supplier 2: Mouser; Supplier Part Number 2: 989-5CGXFC7D7F31C8N; Device Group: 5CGXFC7; RoHS: RoHS Compliant; Subcategory: Cyclone V GX; Voltage Supply: 1.07 to 1.13 V; NexusDeviceID: 5CGXFC7D7F31C8N; Mounting Technology: Surface Mount; Code_JEDEC: MS-034-AAN-1; PartNumber: 5CGXFC7D7F31C8N; ComponentLink1Description: Manufacturer URL; ComponentLink1URL: http://www.altera.com; ComponentLink2Description: Datasheet; ComponentLink2URL: http://www.altera.com/literature/hb/cyclone-v/cv_51002.pdf; ComponentLink3Description: Package Specification; ComponentLink3URL: http://www.altera.com/devicepackaging/04R00435-01.pdf; ComponentLink4Description: Device Handbook URL; ComponentLink4URL: http://www.altera.com/literature/hb/cyclone-v/cyclone5_handbook.pdf; ComponentLink5Description: Device Pin-Out URL; ComponentLink5URL: http://www.altera.com/literature/dp/cyclone-v/5CGXFC7.xls; ComponentLink6Description: Device Overview URL; ComponentLink6URL: http://www.altera.com/literature/hb/cyclone-v/cv_51001.pdf; ComponentLink7Description: Product URL; ComponentLink7URL: http://www.buyaltera.com/scripts/partsearch.dll?Detail&name=5CGXFC7D7F31C8N-ND